# Altium project BV100011_UniversalSlave.PrjPCB (part 1 of 2)
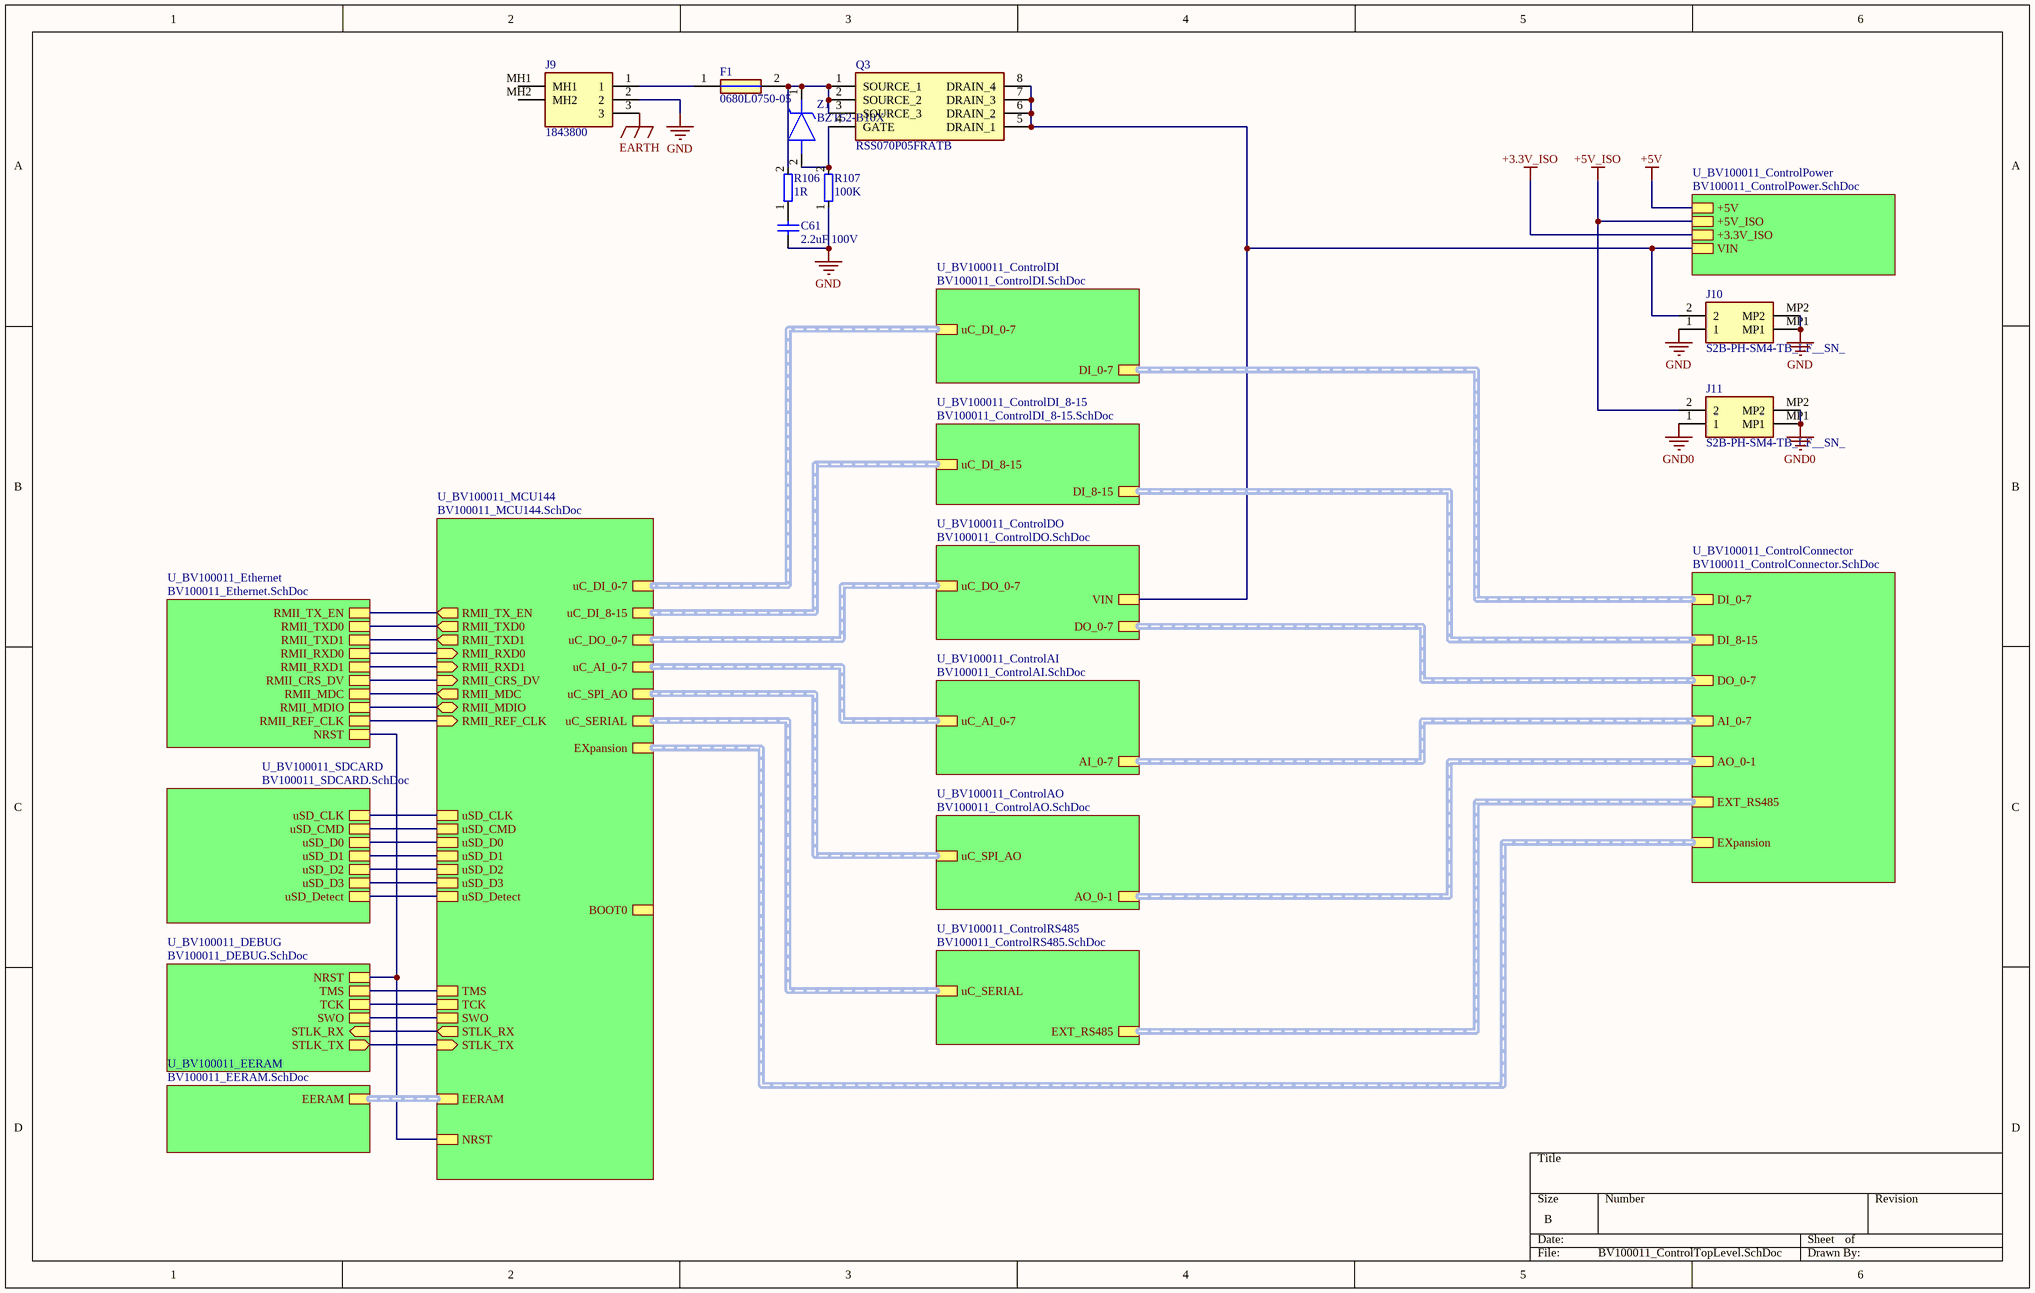
[diagram p0: BV100011_ControlTopLevel.SchDoc]
14 sheets, 453 parts. Net scope: hierarchical (ports join the sheet entries above them; power ports are global).
Board file: BV100011_UniversalSlave.PcbDoc
Sheets:
  BV100011_ControlTopLevel.SchDoc
    U_BV100011_ControlAI = BV100011_ControlAI.SchDoc
    U_BV100011_ControlAO = BV100011_ControlAO.SchDoc
    U_BV100011_ControlDI = BV100011_ControlDI.SchDoc
    U_BV100011_ControlDO = BV100011_ControlDO.SchDoc
    U_BV100011_ControlRS485 = BV100011_ControlRS485.SchDoc
    U_BV100011_ControlPower = BV100011_ControlPower.SchDoc
    U_BV100011_ControlDI_8-15 = BV100011_ControlDI_8-15.SchDoc
    U_BV100011_SDCARD = BV100011_SDCARD.SchDoc
    U_BV100011_Ethernet = BV100011_Ethernet.SchDoc
    U_BV100011_DEBUG = BV100011_DEBUG.SchDoc
    U_BV100011_EERAM = BV100011_EERAM.SchDoc
    U_BV100011_MCU144 = BV100011_MCU144.SchDoc
    U_BV100011_ControlConnector = BV100011_ControlConnector.SchDoc

## Sheet BV100011_ControlTopLevel.SchDoc
size B

### Parts
C61  2.2uF 100V  [C1210]
F1  0680L0750-05  [FUSC6125X279N]
J9  1843800  [1843800]
J10  S2B-PH-SM4-TB_LF__SN_  [S2BPHSM4TBLFSN]
J11  S2B-PH-SM4-TB_LF__SN_  [S2BPHSM4TBLFSN]
Q3  RSS070P05FRATB  [SOIC127P600X175-8N]
R106  1R  [R0805]
R107  100K  [R0603]
Z1  BZT52-B10X  [SODFL3616X130N]

### Sub-sheets
U_BV100011_ControlAI = BV100011_ControlAI.SchDoc: uC_AI_0-7 (harness uC_AI_0-7), AI_0-7 (harness AI_0-7)
U_BV100011_ControlAO = BV100011_ControlAO.SchDoc: AO_0-1 (harness AO_0-1), uC_SPI_AO (harness uC_SPI_AO)
U_BV100011_ControlConnector = BV100011_ControlConnector.SchDoc: DI_0-7 (harness DI_0-7), AI_0-7 (harness AI_0-7), DO_0-7 (harness DO_0-7), AO_0-1 (harness AO_0-1), EXT_RS485 (harness EXT_RS485), DI_8-15 (harness DI_8-15), EXpansion (harness Expansion)
U_BV100011_ControlDI = BV100011_ControlDI.SchDoc: DI_0-7 (harness DI_0-7), uC_DI_0-7 (harness uC_DI_0-7)
U_BV100011_ControlDI_8-15 = BV100011_ControlDI_8-15.SchDoc: DI_8-15 (harness DI_8-15), uC_DI_8-15 (harness uC_DI_8-15)
U_BV100011_ControlDO = BV100011_ControlDO.SchDoc: DO_0-7 (harness DO_0-7), uC_DO_0-7 (harness uC_DO_0-7), VIN
U_BV100011_ControlPower = BV100011_ControlPower.SchDoc: VIN, +5V, +5V_ISO, +3.3V_ISO
U_BV100011_ControlRS485 = BV100011_ControlRS485.SchDoc: uC_SERIAL (harness uC_SERIAL), EXT_RS485 (harness EXT_RS485)
U_BV100011_DEBUG = BV100011_DEBUG.SchDoc: TMS, TCK, SWO, NRST, STLK_RX (in), STLK_TX (out)
U_BV100011_EERAM = BV100011_EERAM.SchDoc: EERAM (harness EERAM)
U_BV100011_Ethernet = BV100011_Ethernet.SchDoc: RMII_TXD0, RMII_TX_EN, RMII_RXD0, RMII_REF_CLK, RMII_CRS_DV, RMII_MDC, RMII_MDIO, NRST, RMII_TXD1, RMII_RXD1
U_BV100011_MCU144 = BV100011_MCU144.SchDoc: NRST, TCK, TMS, SWO, BOOT0, uC_DI_0-7 (harness uC_DI_0-7), uC_DI_8-15 (harness uC_DI_8-15), uC_DO_0-7 (harness uC_DO_0-7), uC_SPI_AO (harness uC_SPI_AO), uC_SERIAL (harness uC_SERIAL), uSD_CLK, uSD_CMD, uSD_D0, uSD_D1, uSD_D2, uSD_D3, uSD_Detect, RMII_REF_CLK (in), RMII_MDIO (bidir), RMII_CRS_DV (in), RMII_RXD0 (in), RMII_MDC (out), RMII_RXD1 (in), RMII_TXD1 (out), RMII_TXD0 (out), RMII_TX_EN (out), STLK_RX (out), STLK_TX (in), uC_AI_0-7 (harness uC_AI_0-7), EERAM (harness EERAM), EXpansion (harness Expansion)
U_BV100011_SDCARD = BV100011_SDCARD.SchDoc: uSD_CLK, uSD_CMD, uSD_D0, uSD_D1, uSD_D2, uSD_D3, uSD_Detect

### Nets
+5V_ISO: J11.2 ; sheet U_BV100011_ControlPower/+5V_ISO
EARTH: J9.3
GND: C61.1 J9.2 J10.1 J10.MP1 J10.MP2 R107.1
GND0: J11.1 J11.MP1 J11.MP2
NRST: sheet U_BV100011_Ethernet/NRST, sheet U_BV100011_DEBUG/NRST, sheet U_BV100011_MCU144/NRST
PA1: sheet U_BV100011_Ethernet/RMII_REF_CLK, sheet U_BV100011_MCU144/RMII_REF_CLK
PA2: sheet U_BV100011_Ethernet/RMII_MDIO, sheet U_BV100011_MCU144/RMII_MDIO
PA7: sheet U_BV100011_Ethernet/RMII_CRS_DV, sheet U_BV100011_MCU144/RMII_CRS_DV
PA13: sheet U_BV100011_DEBUG/TMS, sheet U_BV100011_MCU144/TMS
PA14: sheet U_BV100011_DEBUG/TCK, sheet U_BV100011_MCU144/TCK
PB3: sheet U_BV100011_DEBUG/SWO, sheet U_BV100011_MCU144/SWO
PB13: sheet U_BV100011_Ethernet/RMII_TXD1, sheet U_BV100011_MCU144/RMII_TXD1
PC1: sheet U_BV100011_Ethernet/RMII_MDC, sheet U_BV100011_MCU144/RMII_MDC
PC4: sheet U_BV100011_Ethernet/RMII_RXD0, sheet U_BV100011_MCU144/RMII_RXD0
PC5: sheet U_BV100011_Ethernet/RMII_RXD1, sheet U_BV100011_MCU144/RMII_RXD1
PC8: sheet U_BV100011_SDCARD/uSD_D0, sheet U_BV100011_MCU144/uSD_D0
PC9: sheet U_BV100011_SDCARD/uSD_D1, sheet U_BV100011_MCU144/uSD_D1
PC10: sheet U_BV100011_SDCARD/uSD_D2, sheet U_BV100011_MCU144/uSD_D2
PC11: sheet U_BV100011_SDCARD/uSD_D3, sheet U_BV100011_MCU144/uSD_D3
PC12: sheet U_BV100011_SDCARD/uSD_CLK, sheet U_BV100011_MCU144/uSD_CLK
PD2: sheet U_BV100011_SDCARD/uSD_CMD, sheet U_BV100011_MCU144/uSD_CMD
PD3: sheet U_BV100011_SDCARD/uSD_Detect, sheet U_BV100011_MCU144/uSD_Detect
PD8: sheet U_BV100011_DEBUG/STLK_RX, sheet U_BV100011_MCU144/STLK_RX
PD9: sheet U_BV100011_DEBUG/STLK_TX, sheet U_BV100011_MCU144/STLK_TX
PG11: sheet U_BV100011_Ethernet/RMII_TX_EN, sheet U_BV100011_MCU144/RMII_TX_EN
PG13: sheet U_BV100011_Ethernet/RMII_TXD0, sheet U_BV100011_MCU144/RMII_TXD0
VIN: J10.2 Q3.5(DRAIN_1) Q3.6(DRAIN_2) Q3.7(DRAIN_3) Q3.8(DRAIN_4) ; sheet U_BV100011_ControlDO/VIN, sheet U_BV100011_ControlPower/VIN
NetC61_2: C61.2 R106.1
NetF1_1: F1.1 J9.1
NetF1_2: F1.2 Q3.1(SOURCE_1) Q3.2(SOURCE_2) Q3.3(SOURCE_3) R106.2 Z1.1(K)
NetQ3_4: Q3.4(GATE) R107.2 Z1.2(A)

Not connected (* = marked no-connect by the designer): J9 MH1 MH2

### Buses and harness runs
harness sheet U_BV100011_ControlAI/AI_0-7 = sheet U_BV100011_ControlConnector/AI_0-7
harness sheet U_BV100011_ControlAI/uC_AI_0-7 = sheet U_BV100011_MCU144/uC_AI_0-7
harness sheet U_BV100011_ControlAO/AO_0-1 = sheet U_BV100011_ControlConnector/AO_0-1
harness sheet U_BV100011_ControlAO/uC_SPI_AO = sheet U_BV100011_MCU144/uC_SPI_AO
harness sheet U_BV100011_ControlConnector/DI_0-7 = sheet U_BV100011_ControlDI/DI_0-7
harness sheet U_BV100011_ControlConnector/DI_8-15 = sheet U_BV100011_ControlDI_8-15/DI_8-15
harness sheet U_BV100011_ControlConnector/DO_0-7 = sheet U_BV100011_ControlDO/DO_0-7
harness sheet U_BV100011_ControlConnector/EXpansion = sheet U_BV100011_MCU144/EXpansion
harness sheet U_BV100011_ControlConnector/EXT_RS485 = sheet U_BV100011_ControlRS485/EXT_RS485
harness sheet U_BV100011_ControlDI/uC_DI_0-7 = sheet U_BV100011_MCU144/uC_DI_0-7
harness sheet U_BV100011_ControlDI_8-15/uC_DI_8-15 = sheet U_BV100011_MCU144/uC_DI_8-15
harness sheet U_BV100011_ControlDO/uC_DO_0-7 = sheet U_BV100011_MCU144/uC_DO_0-7
harness sheet U_BV100011_ControlRS485/uC_SERIAL = sheet U_BV100011_MCU144/uC_SERIAL
harness sheet U_BV100011_EERAM/EERAM = sheet U_BV100011_MCU144/EERAM

### Library data of the parts
C61 = Cap: Capacitor; Value: 0.01uF; Published: 8-Jun-2000; LatestRevisionDate: 17-Jul-2002; LatestRevisionNote: Re-released for DXP Platform.; PackageReference: RAD-0.3; Publisher: Altium Limited
F1 = 0680L0750-05: Fuse; Manufacturer_Name: Stewart Connector; Datasheet Link: https://belfuse.com/resources/datasheets/circuitprotection/ds-cp-0680l-series.pdf; Height: 2.79mm; Manufacturer_Part_Number: 0680L0750-05; Mouser Part Number: 530-0680L0750-05; Mouser Price/Stock: https://www.mouser.co.uk/ProductDetail/Bel-Fuse/0680L0750-05?qs=XeJtXLiO41Q8xKKngRilvg%3D%3D
J9 = 1843800: Connector; Manufacturer_Name: Phoenix Contact; Datasheet Link: https://www.phoenixcontact.com/online/portal/gb?uri=pxc-oc-itemdetail:pid=1843800&library=gben&tab=1; Height: 7.4mm; Manufacturer_Part_Number: 1843800; Arrow Part Number: 1843800; Arrow Price/Stock: https://www.arrow.com/en/products/1843800/phoenix-contact; Mouser Part Number: 651-1843800; Mouser Price/Stock: https://www.mouser.co.uk/ProductDetail/Phoenix-Contact/1843800?qs=uJX40y%252BSWqgV2WPXXVa%2FDw%3D%3D
J10 J11 = S2B-PH-SM4-TB_LF__SN_: Connector; Manufacturer_Name: JST Sales America; Manufacturer_Part_Number: S2B-PH-SM4-TB(LF)(SN); Datasheet Link: https://www.jst-mfg.com/product/pdf/eng/ePH.pdf; Height: 6.6mm
Q3 = RSS070P05FRATB: MOSFET (P-Channel); Manufacturer_Name: ROHM Semiconductor; Datasheet Link: https://d1d2qsbl8m0m72.cloudfront.net/en/products/databook/datasheet/discrete/transistor/mosfet/rss070p05fra-e.pdf; Height: 1.75mm; Manufacturer_Part_Number: RSS070P05FRATB; Mouser Part Number: 755-RSS070P05FRATB; Mouser Price/Stock: https://www.mouser.com/Search/Refine.aspx?Keyword=755-RSS070P05FRATB
R106 R107 = µç×è£¨1£©: Resistor
Z1 = BZT52-B10X: Zener Diode; Manufacturer_Name: Nexperia; Datasheet Link: https://componentsearchengine.com/Datasheets/2/BZT52-B10X.pdf; Height: 1.3mm; Manufacturer_Part_Number: BZT52-B10X; Arrow Part Number: BZT52-B10X; Arrow Price/Stock: https://www.arrow.com/en/products/bzt52-b10x/nexperia; Mouser Part Number: 771-BZT52-B10X; Mouser Price/Stock: https://www.mouser.co.uk/ProductDetail/Nexperia/BZT52-B10X?qs=W0yvOO0ixfEZrHW2hWNc1Q%3D%3D

## Sheet BV100011_ControlAI.SchDoc
size C
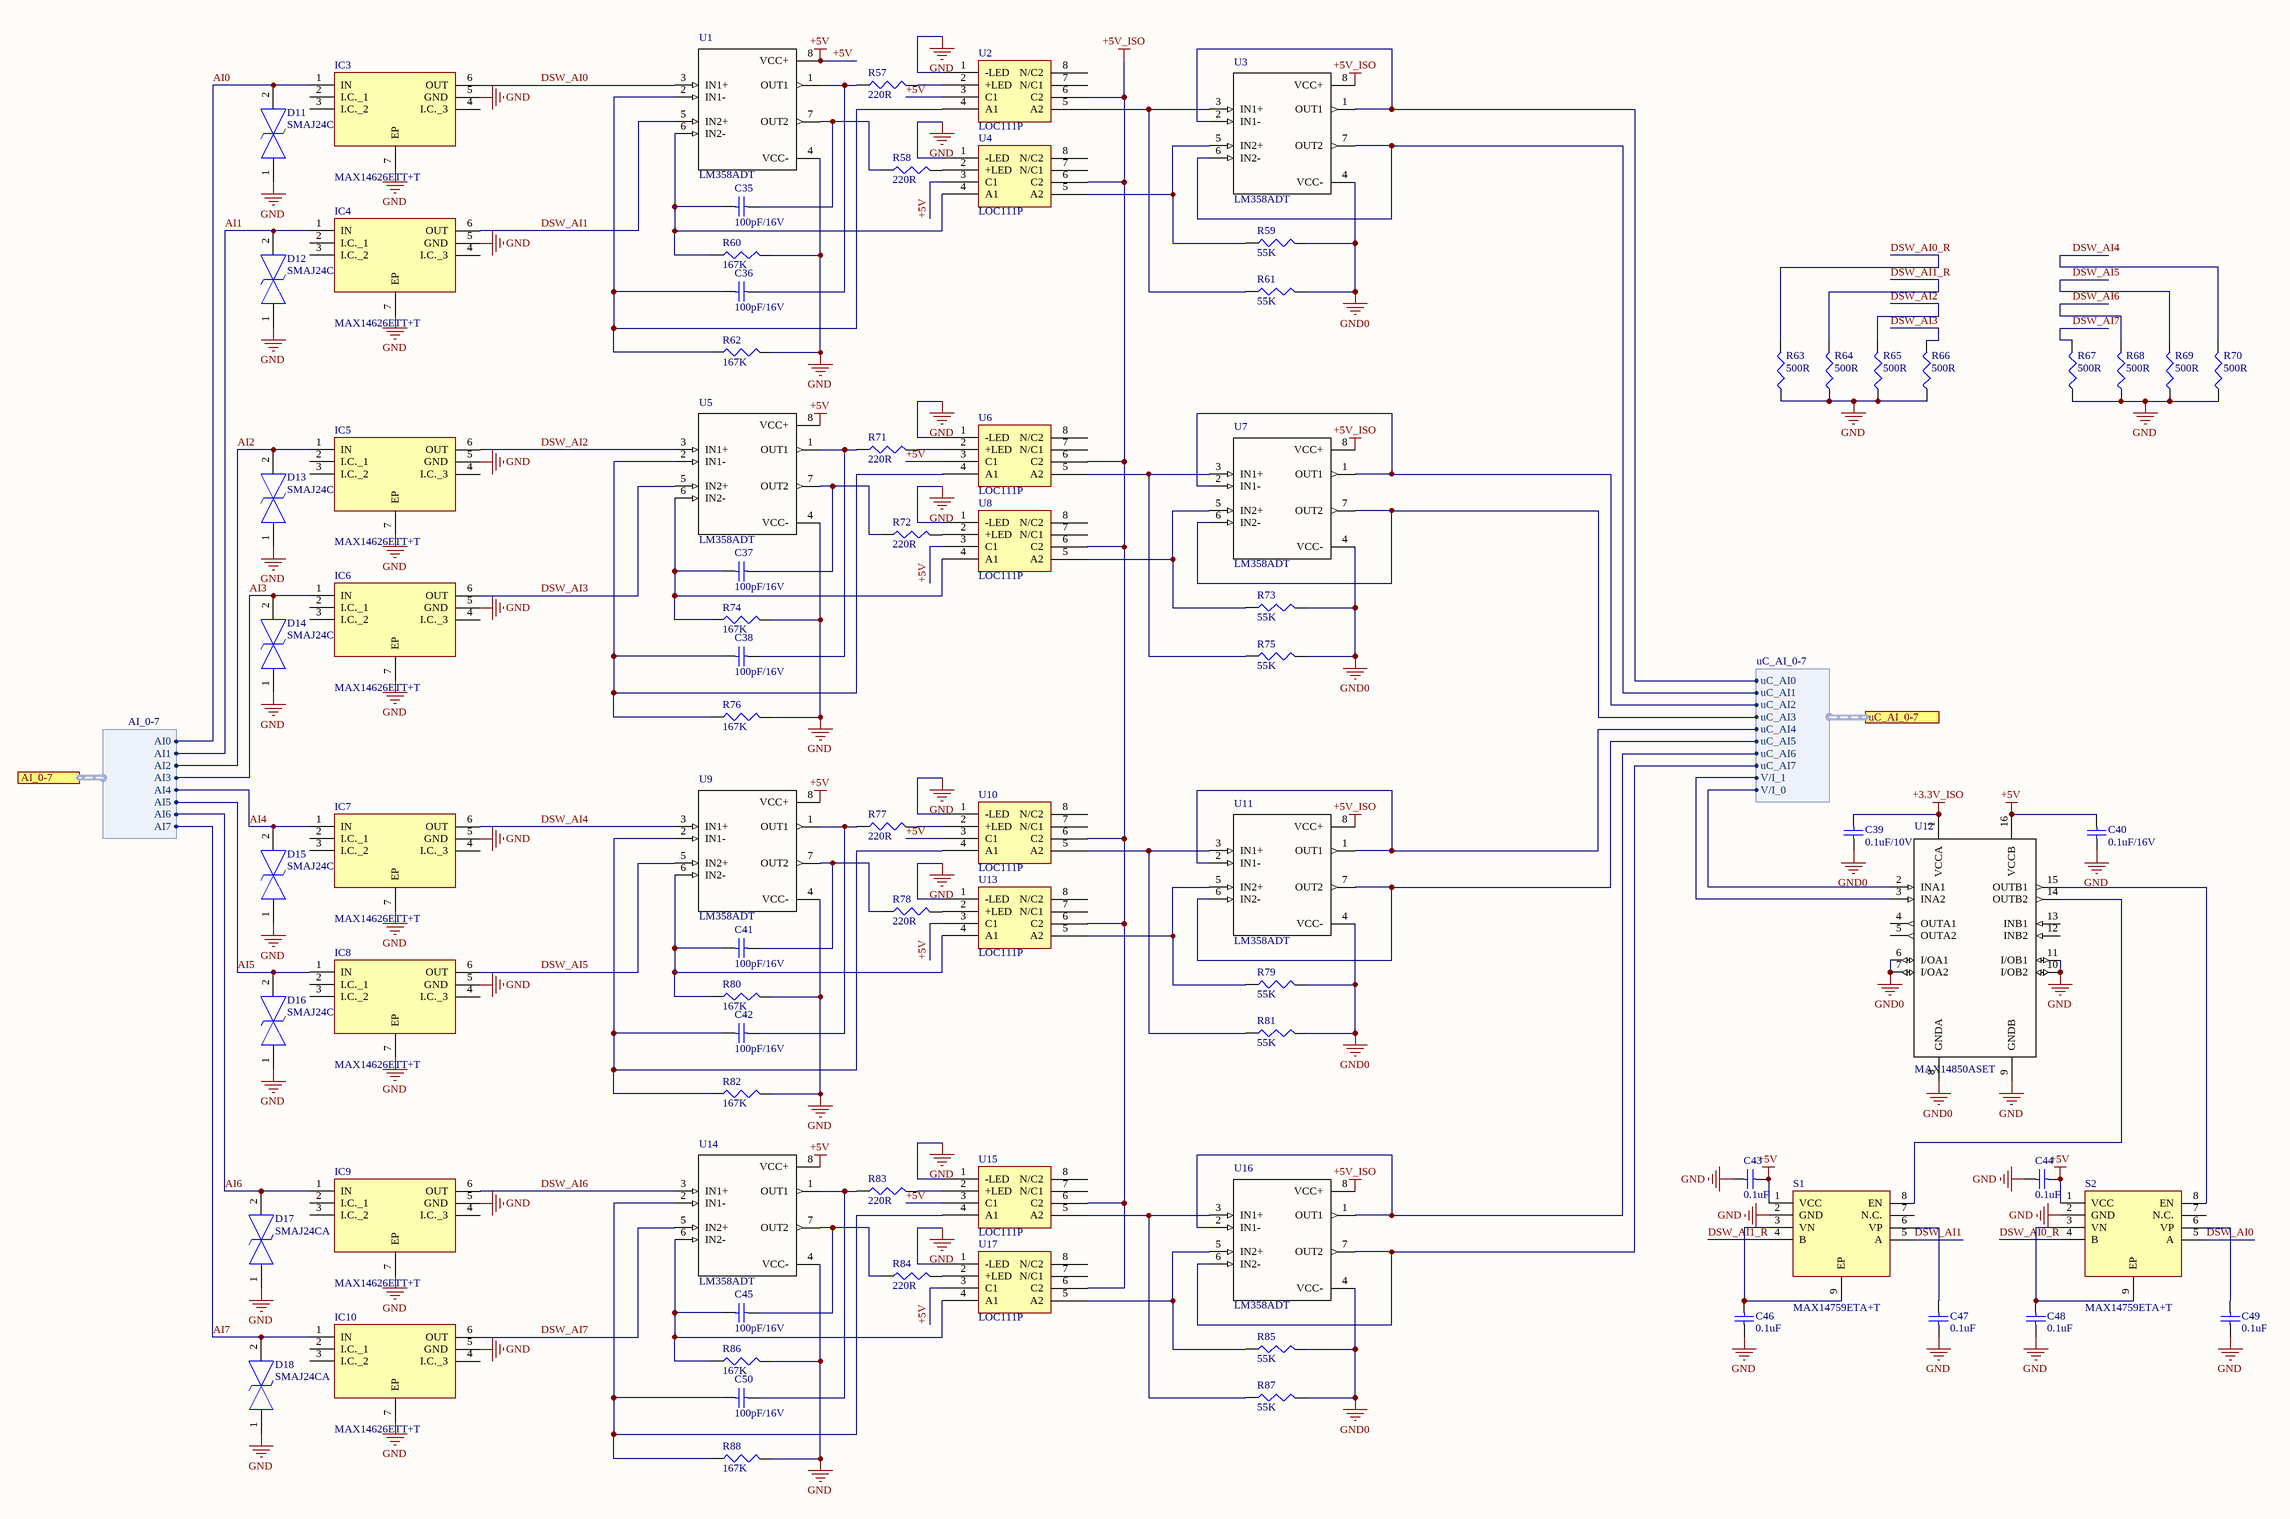
[diagram p1: BV100011_ControlAI.SchDoc]

### Parts
C35  100pF/16V  [C1206]
C36  100pF/16V  [C1206]
C37  100pF/16V  [C1206]
C38  100pF/16V  [C1206]
C39  0.1uF/10V  [C1206]
C40  0.1uF/16V  [C1206]
C41  100pF/16V  [C1206]
C42  100pF/16V  [C1206]
C43  0.1uF  [C1206]
C44  0.1uF  [C1206]
C45  100pF/16V  [C1206]
C46  0.1uF  [C1206]
C47  0.1uF  [C1206]
C48  0.1uF  [C1206]
C49  0.1uF  [C1206]
C50  100pF/16V  [C1206]
D11  SMAJ24CA  [DIONM5026X229N]
D12  SMAJ24CA  [DIONM5026X229N]
D13  SMAJ24CA  [DIONM5026X229N]
D14  SMAJ24CA  [DIONM5026X229N]
D15  SMAJ24CA  [DIONM5026X229N]
D16  SMAJ24CA  [DIONM5026X229N]
D17  SMAJ24CA  [DIONM5026X229N]
D18  SMAJ24CA  [DIONM5026X229N]
IC3  MAX14626ETT+T  [SON95P300X300X80-7N]
IC4  MAX14626ETT+T  [SON95P300X300X80-7N]
IC5  MAX14626ETT+T  [SON95P300X300X80-7N]
IC6  MAX14626ETT+T  [SON95P300X300X80-7N]
IC7  MAX14626ETT+T  [SON95P300X300X80-7N]
IC8  MAX14626ETT+T  [SON95P300X300X80-7N]
IC9  MAX14626ETT+T  [SON95P300X300X80-7N]
IC10  MAX14626ETT+T  [SON95P300X300X80-7N]
R57  220R  [J1-0603]
R58  220R  [J1-0603]
R59  55K  [J1-0603]
R60  167K  [J1-0603]
R61  55K  [J1-0603]
R62  167K  [J1-0603]
R63  500R  [14-1210]
R64  500R  [14-1210]
R65  500R  [14-1210]
R66  500R  [14-1210]
R67  500R  [14-1210]
R68  500R  [14-1210]
R69  500R  [14-1210]
R70  500R  [14-1210]
R71  220R  [J1-0603]
R72  220R  [J1-0603]
R73  55K  [J1-0603]
R74  167K  [J1-0603]
R75  55K  [J1-0603]
R76  167K  [J1-0603]
R77  220R  [J1-0603]
R78  220R  [J1-0603]
R79  55K  [J1-0603]
R80  167K  [J1-0603]
R81  55K  [J1-0603]
R82  167K  [J1-0603]
R83  220R  [J1-0603]
R84  220R  [J1-0603]
R85  55K  [J1-0603]
R86  167K  [J1-0603]
R87  55K  [J1-0603]
R88  167K  [J1-0603]
S1  MAX14759ETA+T  [SON65P300X300X80-9N]
S2  MAX14759ETA+T  [SON65P300X300X80-9N]
U1  LM358ADT  [*SOIC127P600X175-8N]
U2  LOC111P  [SOP254P940X265-8N]
U3  LM358ADT  [*SOIC127P600X175-8N]
U4  LOC111P  [SOP254P940X265-8N]
U5  LM358ADT  [*SOIC127P600X175-8N]
U6  LOC111P  [SOP254P940X265-8N]
U7  LM358ADT  [*SOIC127P600X175-8N]
U8  LOC111P  [SOP254P940X265-8N]
U9  LM358ADT  [*SOIC127P600X175-8N]
U10  LOC111P  [SOP254P940X265-8N]
U11  LM358ADT  [*SOIC127P600X175-8N]
U12  MAX14850ASET  [*SOIC127P600X175-16N]
U13  LOC111P  [SOP254P940X265-8N]
U14  LM358ADT  [*SOIC127P600X175-8N]
U15  LOC111P  [SOP254P940X265-8N]
U16  LM358ADT  [*SOIC127P600X175-8N]
U17  LOC111P  [SOP254P940X265-8N]

### Ports
AI_0-7 (harness AI_0-7), uC_AI_0-7 (harness uC_AI_0-7)

### Harnesses
uC_AI_0-7: uC_AI0, uC_AI1, uC_AI2, uC_AI3, uC_AI4, uC_AI5, uC_AI6, uC_AI7, V/I_0, V/I_1
AI_0-7: AI0, AI1, AI2, AI3, AI4, AI5, AI6, AI7

### Nets
+3.3V_ISO: C39.1 U12.1(VCCA)
+5V: C40.1 C43.2 C44.2 S1.1(VCC) S2.1(VCC) U1.8(VCC+) U2.3(C1) U4.3(C1) U5.8(VCC+) U6.3(C1) U8.3(C1) U9.8(VCC+) U10.3(C1) U12.16(VCCB) U13.3(C1) U14.8(VCC+) U15.3(C1) U17.3(C1)
+5V_ISO: U2.6(C2) U3.8(VCC+) U4.6(C2) U6.6(C2) U7.8(VCC+) U8.6(C2) U10.6(C2) U11.8(VCC+) U13.6(C2) U15.6(C2) U16.8(VCC+) U17.6(C2)
GND: C40.2 C43.1 C44.1 C46.2 C47.2 C48.2 C49.2 D11.1(K) D12.1(K) D13.1(K) D14.1(K) D15.1(K) D16.1(K) D17.1(K) D18.1(K) IC3.5(GND) IC3.7(EP) IC4.5(GND) IC4.7(EP) IC5.5(GND) IC5.7(EP) IC6.5(GND) IC6.7(EP) IC7.5(GND) IC7.7(EP) IC8.5(GND) IC8.7(EP) IC9.5(GND) IC9.7(EP) IC10.5(GND) IC10.7(EP) R60.2 R62.2 R63.1 R64.1 R65.1 R66.1 R67.1 R68.1 R69.1 R70.1 R74.2 R76.2 R80.2 R82.2 R86.2 R88.2 S1.2(GND) S2.2(GND) U1.4(VCC-) U2.1(-LED) U4.1(-LED) U5.4(VCC-) U6.1(-LED) U8.1(-LED) U9.4(VCC-) U10.1(-LED) U12.9(GNDB) U12.10(I/OB2) U12.11(I/OB1) U13.1(-LED) U14.4(VCC-) U15.1(-LED) U17.1(-LED)
GND0: C39.2 R59.2 R61.2 R73.2 R75.2 R79.2 R81.2 R85.2 R87.2 U3.4(VCC-) U7.4(VCC-) U11.4(VCC-) U12.6(I/OA1) U12.7(I/OA2) U12.8(GNDA) U16.4(VCC-)
AI0: D11.2(A) IC3.1(IN) ; port AI_0-7.AI0
AI1: D12.2(A) IC4.1(IN) ; port AI_0-7.AI1
AI2: D13.2(A) IC5.1(IN) ; port AI_0-7.AI2
AI3: D14.2(A) IC6.1(IN) ; port AI_0-7.AI3
AI4: D15.2(A) IC7.1(IN) ; port AI_0-7.AI4
AI5: D16.2(A) IC8.1(IN) ; port AI_0-7.AI5
AI6: D17.2(A) IC9.1(IN) ; port AI_0-7.AI6
AI7: D18.2(A) IC10.1(IN) ; port AI_0-7.AI7
DSW_AI0: IC3.6(OUT) S2.5(A) U1.3(IN1+)
DSW_AI0_R: R63.2 S2.4(B)
DSW_AI1: IC4.6(OUT) S1.5(A) U1.5(IN2+)
DSW_AI1_R: R64.2 S1.4(B)
DSW_AI2: IC5.6(OUT) R65.2 U5.3(IN1+)
DSW_AI3: IC6.6(OUT) R66.2 U5.5(IN2+)
DSW_AI4: IC7.6(OUT) R70.2 U9.3(IN1+)
DSW_AI5: IC8.6(OUT) R69.2 U9.5(IN2+)
DSW_AI6: IC9.6(OUT) R68.2 U14.3(IN1+)
DSW_AI7: IC10.6(OUT) R67.2 U14.5(IN2+)
PA0: U3.1(OUT1) U3.2(IN1-) ; port uC_AI_0-7.uC_AI0
PA3: U3.6(IN2-) U3.7(OUT2) ; port uC_AI_0-7.uC_AI1
PA4: U7.1(OUT1) U7.2(IN1-) ; port uC_AI_0-7.uC_AI2
PA5: U7.6(IN2-) U7.7(OUT2) ; port uC_AI_0-7.uC_AI3
PA6: U11.1(OUT1) U11.2(IN1-) ; port uC_AI_0-7.uC_AI4
PB1: U11.6(IN2-) U11.7(OUT2) ; port uC_AI_0-7.uC_AI5
PC0: U16.1(OUT1) U16.2(IN1-) ; port uC_AI_0-7.uC_AI6
PC3: U16.6(IN2-) U16.7(OUT2) ; port uC_AI_0-7.uC_AI7
PG0: U12.2(INA1) ; port uC_AI_0-7.V/I_0
PG1: U12.3(INA2) ; port uC_AI_0-7.V/I_1
NetC35_1: C35.1 R60.1 U1.6(IN2-) U4.4(A1)
NetC35_2: C35.2 R58.1 U1.7(OUT2)
NetC36_1: C36.1 R62.1 U1.2(IN1-) U2.4(A1)
NetC36_2: C36.2 R57.1 U1.1(OUT1)
NetC37_1: C37.1 R74.1 U5.6(IN2-) U8.4(A1)
NetC37_2: C37.2 R72.1 U5.7(OUT2)
NetC38_1: C38.1 R76.1 U5.2(IN1-) U6.4(A1)
NetC38_2: C38.2 R71.1 U5.1(OUT1)
NetC41_1: C41.1 R80.1 U9.6(IN2-) U13.4(A1)
NetC41_2: C41.2 R78.1 U9.7(OUT2)
NetC42_1: C42.1 R82.1 U9.2(IN1-) U10.4(A1)
NetC42_2: C42.2 R77.1 U9.1(OUT1)
NetC45_1: C45.1 R86.1 U14.6(IN2-) U17.4(A1)
NetC45_2: C45.2 R84.1 U14.7(OUT2)
NetC46_1: C46.1 S1.3(VN) S1.9(EP)
NetC47_1: C47.1 S1.6(VP)
NetC48_1: C48.1 S2.3(VN) S2.9(EP)
NetC49_1: C49.1 S2.6(VP)
NetC50_1: C50.1 R88.1 U14.2(IN1-) U15.4(A1)
NetC50_2: C50.2 R83.1 U14.1(OUT1)
NetR57_2: R57.2 U2.2(+LED)
NetR58_2: R58.2 U4.2(+LED)
NetR59_1: R59.1 U3.5(IN2+) U4.5(A2)
NetR61_1: R61.1 U2.5(A2) U3.3(IN1+)
NetR71_2: R71.2 U6.2(+LED)
NetR72_2: R72.2 U8.2(+LED)
NetR73_1: R73.1 U7.5(IN2+) U8.5(A2)
NetR75_1: R75.1 U6.5(A2) U7.3(IN1+)
NetR77_2: R77.2 U10.2(+LED)
NetR78_2: R78.2 U13.2(+LED)
NetR79_1: R79.1 U11.5(IN2+) U13.5(A2)
NetR81_1: R81.1 U10.5(A2) U11.3(IN1+)
NetR83_2: R83.2 U15.2(+LED)
NetR84_2: R84.2 U17.2(+LED)
NetR85_1: R85.1 U16.5(IN2+) U17.5(A2)
NetR87_1: R87.1 U15.5(A2) U16.3(IN1+)
NetS1_8: S1.8(EN) U12.14(OUTB2)
NetS2_8: S2.8(EN) U12.15(OUTB1)

Not connected (* = marked no-connect by the designer): IC3 2(I.C._1) 3(I.C._2) 4(I.C._3); IC4 2(I.C._1) 3(I.C._2) 4(I.C._3); IC5 2(I.C._1) 3(I.C._2) 4(I.C._3); IC6 2(I.C._1) 3(I.C._2) 4(I.C._3); IC7 2(I.C._1) 3(I.C._2) 4(I.C._3); IC8 2(I.C._1) 3(I.C._2) 4(I.C._3); IC9 2(I.C._1) 3(I.C._2) 4(I.C._3); IC10 2(I.C._1) 3(I.C._2) 4(I.C._3); S1 7(N.C.); S2 7(N.C.); U2 7(N/C1) 8(N/C2); U4 7(N/C1) 8(N/C2); U6 7(N/C1) 8(N/C2); U8 7(N/C1) 8(N/C2); U10 7(N/C1) 8(N/C2); U12 4(OUTA1) 5(OUTA2) 12(INB2) 13(INB1); U13 7(N/C1) 8(N/C2); U15 7(N/C1) 8(N/C2); U17 7(N/C1) 8(N/C2)

### Library data of the parts
C35-C42 C45 C50 = Cap Semi: Capacitor (Semiconductor SIM Model); Published: 8-Jun-2000; LatestRevisionDate: 29-May-2009; LatestRevisionNote: IPC-7351 Footprint Added.; PackageReference: C1206; Publisher: Altium Limited; PackageDescription: Chip Capacitor
  C35-C38 C41 C42 C45 C50: Value: 100pF/16V
  C39: Value: 0.1uF/10V
  C40: Value: 0.1uF/16V
C43 C44 C46-C49 = Cap Semi: Capacitor (Semiconductor SIM Model); Value: 100pF/16V; Published: 8-Jun-2000; LatestRevisionDate: 29-May-2009; LatestRevisionNote: IPC-7351 Footprint Added.; PackageReference: C1206; Publisher: Altium Limited; PackageDescription: Chip Capacitor
D11-D18 = SMAJ24CA: TVS Diode (Bi-directional); Manufacturer_Name: LITTELFUSE; Datasheet Link: http://www.littelfuse.com/~/media/electronics/datasheets/tvs_diodes/littelfuse_tvs_diode_smaj_datasheet.pdf.pdf; Height: 2.29mm; Manufacturer_Part_Number: SMAJ24CA; Mouser Part Number: 576-SMAJ24CA; Mouser Price/Stock: https://www.mouser.com/Search/Refine.aspx?Keyword=576-SMAJ24CA; RS Part Number: 1719613P; RS Price/Stock: http://uk.rs-online.com/web/p/products/1719613P
IC3-IC10 = MAX14626ETT+T: Integrated Circuit; Manufacturer_Name: Maxim Integrated; Datasheet Link: http://datasheets.maximintegrated.com/en/ds/MAX14626.pdf; Height: 0.8mm; Manufacturer_Part_Number: MAX14626ETT+T; Mouser Part Number: 700-MAX14626ETT+T; Mouser Price/Stock: https://www.mouser.co.uk/ProductDetail/Maxim-Integrated/MAX14626ETT%2bT?qs=Vwh6e7toGLjhMUByPdHdJg%3D%3D
R57-R88 = Res3: Resistor; Published: 8-Jun-2000; LatestRevisionDate: 29-May-2009; LatestRevisionNote: IPC-7351 Footprint Added.; PackageReference: J1-0603; Publisher: Altium Limited; PackageDescription: Chip Resistor
  R57 R58 R71 R72 R77 R78 R83 R84: Value: 220R
  R59 R61 R73 R75 R79 R81 R85 R87: Value: 55K
  R60 R62 R74 R76 R80 R82 R86 R88: Value: 167K
  R63-R70: Value: 500R
S1 S2 = MAX14759ETA+T: Switch; Manufacturer_Name: Maxim Integrated; Datasheet Link: https://datasheets.maximintegrated.com/en/ds/MAX14759-MAX14763.pdf; Height: 0.8mm; Manufacturer_Part_Number: MAX14759ETA+T; Mouser Part Number: 700-MAX14759ETA+T; Mouser Price/Stock: https://www.mouser.co.uk/ProductDetail/Maxim-Integrated/MAX14759ETA%2bT?qs=2cAdsCoAWRFgTjPJwgxqqQ%3D%3D
U1 U3 U5 U7 U9 U11 U14 U16 = LM358ADT: LM358 Series 30 V 1.1 MHz Low Power Dual Operational Amplifier - SOIC-8; MF: STMicroelectronics; SnapEDA_Link: https://www.snapeda.com/parts/LM358ADT/STMicroelectronics/view-part/?ref=snap; MP: LM358ADT; Availability: Unavailable; Price: None; Package: SOIC-8 STMicroelectronics; Value: *
U2 U4 U6 U8 U10 U13 U15 U17 = LOC111P: Linear Optocoupler
U12 = MAX14850ASET: Digital Isolator, 6-Ch, 30ns, Nsoic-16; MF: Maxim Integrated; MP: MAX14850ASE+; SnapEDA_Link: https://www.snapeda.com/parts/MAX14850ASE%2B/Maxim%20Integrated/view-part/?ref=snap; Availability: Unavailable; Price: None; Package: SOIC-16 Maxim; Value: *

## Sheet BV100011_ControlAO.SchDoc
size A2
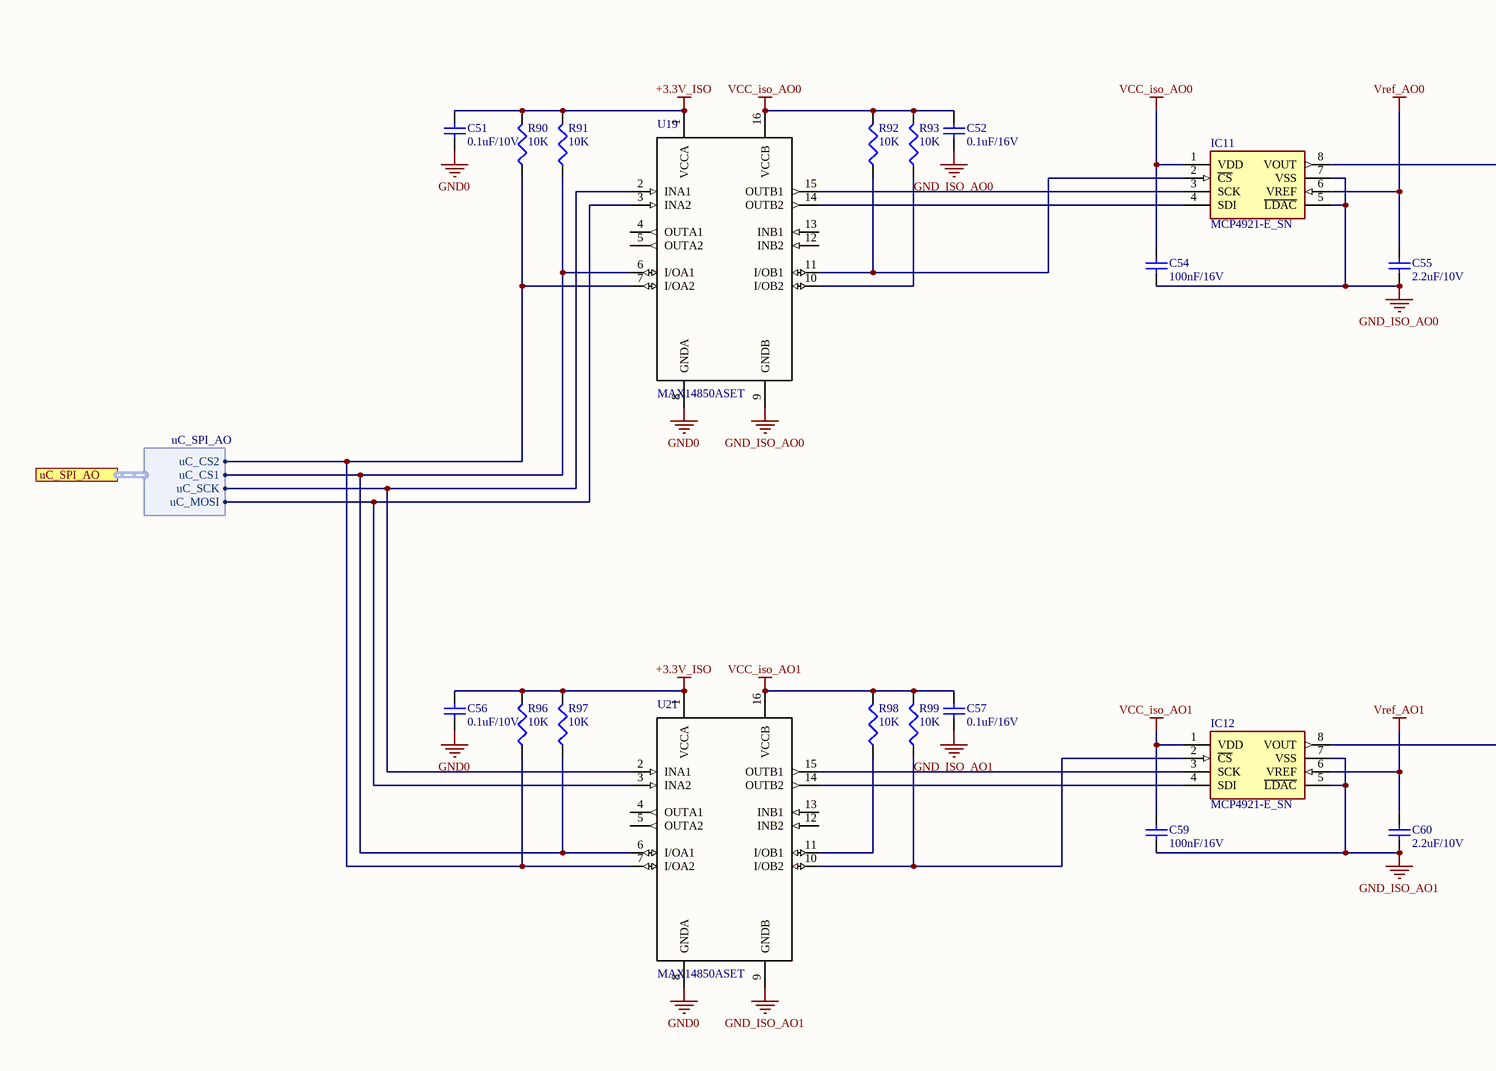
[diagram p2: BV100011_ControlAO.SchDoc, left]
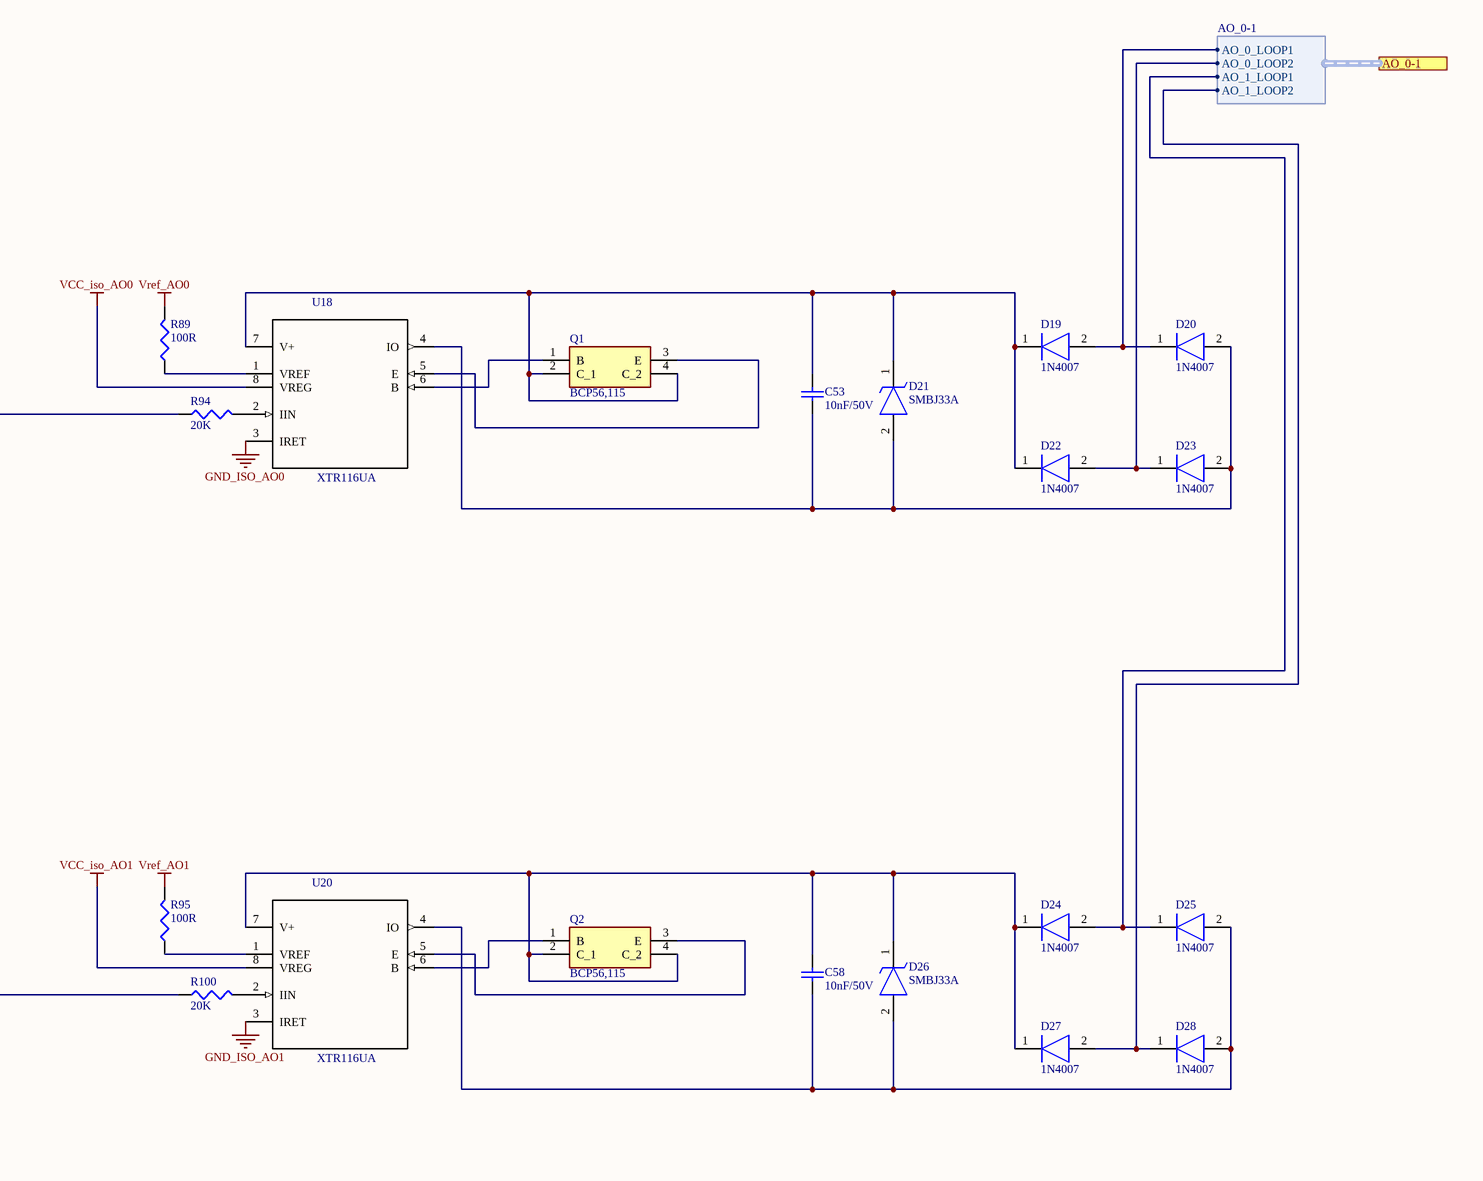
[diagram p3: BV100011_ControlAO.SchDoc, right]

### Parts
C51  0.1uF/10V  [C1206]
C52  0.1uF/16V  [C1206]
C53  10nF/50V  [C1210]
C54  100nF/16V  [C1206]
C55  2.2uF/10V  [C1206]
C56  0.1uF/10V  [C1206]
C57  0.1uF/16V  [C1206]
C58  10nF/50V  [C1210]
C59  100nF/16V  [C1206]
C60  2.2uF/10V  [C1206]
D19  1N4007  [DIOM5327X242N]
D20  1N4007  [DIOM5327X242N]
D21  SMBJ33A  [DIOM5336X265N]
D22  1N4007  [DIOM5327X242N]
D23  1N4007  [DIOM5327X242N]
D24  1N4007  [DIOM5327X242N]
D25  1N4007  [DIOM5327X242N]
D26  SMBJ33A  [DIOM5336X265N]
D27  1N4007  [DIOM5327X242N]
D28  1N4007  [DIOM5327X242N]
IC11  MCP4921-E_SN  [SOIC127P600X175-8N]
IC12  MCP4921-E_SN  [SOIC127P600X175-8N]
Q1  BCP56,115  [SOT230P700X180-4N]
Q2  BCP56,115  [SOT230P700X180-4N]
R89  100R  [J1-0603]
R90  10K  [J1-0603]
R91  10K  [J1-0603]
R92  10K  [J1-0603]
R93  10K  [J1-0603]
R94  20K  [J1-0603]
R95  100R  [J1-0603]
R96  10K  [J1-0603]
R97  10K  [J1-0603]
R98  10K  [J1-0603]
R99  10K  [J1-0603]
R100  20K  [J1-0603]
U18  XTR116UA  [*SOIC127P600X175-8N]
U19  MAX14850ASET  [*SOIC127P600X175-16N]
U20  XTR116UA  [*SOIC127P600X175-8N]
U21  MAX14850ASET  [*SOIC127P600X175-16N]

### Ports
AO_0-1 (harness AO_0-1), uC_SPI_AO (harness uC_SPI_AO)

### Harnesses
AO_0-1: AO_0_LOOP1, AO_0_LOOP2, AO_1_LOOP1, AO_1_LOOP2
uC_SPI_AO: uC_CS1, uC_CS2, uC_SCK, uC_MOSI

### Nets
+3.3V_ISO: C51.1 C56.1 R90.2 R91.2 R96.2 R97.2 U19.1(VCCA) U21.1(VCCA)
GND0: C51.2 C56.2 U19.8(GNDA) U21.8(GNDA)
GND_ISO_AO0: C52.2 C54.1 C55.1 IC11.5(~{LDAC}) IC11.7(VSS) U18.3(IRET) U19.9(GNDB)
GND_ISO_AO1: C57.2 C59.1 C60.1 IC12.5(~{LDAC}) IC12.7(VSS) U20.3(IRET) U21.9(GNDB)
VCC_iso_AO0: C52.1 C54.2 IC11.1(VDD) R92.2 R93.2 U18.8(VREG) U19.16(VCCB)
VCC_iso_AO1: C57.1 C59.2 IC12.1(VDD) R98.2 R99.2 U20.8(VREG) U21.16(VCCB)
Vref_AO0: C55.2 IC11.6(VREF) R89.2
Vref_AO1: C60.2 IC12.6(VREF) R95.2
PB10: U19.2(INA1) U21.2(INA1) ; port uC_SPI_AO.uC_SCK
PB11: R91.1 R97.1 U19.6(I/OA1) U21.6(I/OA1) ; port uC_SPI_AO.uC_CS1
PB12: R90.1 R96.1 U19.7(I/OA2) U21.7(I/OA2) ; port uC_SPI_AO.uC_CS2
PB15: U19.3(INA2) U21.3(INA2) ; port uC_SPI_AO.uC_MOSI
NetC53_1: C53.1 D20.2(A) D21.2(A) D23.2(A) U18.4(IO)
NetC53_2: C53.2 D19.1(K) D21.1(K) D22.1(K) Q1.2(C_1) Q1.4(C_2) U18.7(V+)
NetC58_1: C58.1 D25.2(A) D26.2(A) D28.2(A) U20.4(IO)
NetC58_2: C58.2 D24.1(K) D26.1(K) D27.1(K) Q2.2(C_1) Q2.4(C_2) U20.7(V+)
NetD19_2: D19.2(A) D20.1(K) ; port AO_0-1.AO_0_LOOP1
NetD22_2: D22.2(A) D23.1(K) ; port AO_0-1.AO_0_LOOP2
NetD24_2: D24.2(A) D25.1(K) ; port AO_0-1.AO_1_LOOP1
NetD27_2: D27.2(A) D28.1(K) ; port AO_0-1.AO_1_LOOP2
NetIC11_2: IC11.2(~{CS}) R92.1 U19.11(I/OB1)
NetIC11_3: IC11.3(SCK) U19.15(OUTB1)
NetIC11_4: IC11.4(SDI) U19.14(OUTB2)
NetIC11_8: IC11.8(VOUT) R94.1
NetIC12_2: IC12.2(~{CS}) R99.1 U21.10(I/OB2)
NetIC12_3: IC12.3(SCK) U21.15(OUTB1)
NetIC12_4: IC12.4(SDI) U21.14(OUTB2)
NetIC12_8: IC12.8(VOUT) R100.1
NetQ1_1: Q1.1(B) U18.6(B)
NetQ1_3: Q1.3(E) U18.5(E)
NetQ2_1: Q2.1(B) U20.6(B)
NetQ2_3: Q2.3(E) U20.5(E)
NetR89_1: R89.1 U18.1(VREF)
NetR93_1: R93.1 U19.10(I/OB2)
NetR94_2: R94.2 U18.2(IIN)
NetR95_1: R95.1 U20.1(VREF)
NetR98_1: R98.1 U21.11(I/OB1)
NetR100_2: R100.2 U20.2(IIN)

Not connected (* = marked no-connect by the designer): U19 4(OUTA1) 5(OUTA2) 12(INB2) 13(INB1); U21 4(OUTA1) 5(OUTA2) 12(INB2) 13(INB1)

### Library data of the parts
C51-C60 = Cap Semi: Capacitor (Semiconductor SIM Model); Published: 8-Jun-2000; LatestRevisionDate: 29-May-2009; LatestRevisionNote: IPC-7351 Footprint Added.; PackageReference: C1206; Publisher: Altium Limited; PackageDescription: Chip Capacitor
  C51 C56: Value: 0.1uF/10V
  C52 C57: Value: 0.1uF/16V
  C53 C58: Value: 10nF/50V
  C54 C59: Value: 100nF/16V
  C55 C60: Value: 2.2uF/10V
D19 D20 D22-D25 D27 D28 = 1N4007: Diode; Manufacturer_Name: Shikues; Datasheet Link: https://datasheet.lcsc.com/szlcsc/SK-1N4007_C126233.pdf; Height: 2.42mm; Manufacturer_Part_Number: 1N4007
D21 D26 = SMBJ33A: TVS Diode (Uni-directional); Manufacturer_Name: ON Semiconductor; Datasheet Link: http://www.onsemi.com/pub/Collateral/SMBJ9V0CA-D.pdf; Height: 2.65mm; Manufacturer_Part_Number: SMBJ33A; Mouser Part Number: 512-SMBJ33A; Mouser Price/Stock: https://www.mouser.com/Search/Refine.aspx?Keyword=512-SMBJ33A; RS Part Number: 8022320P; RS Price/Stock: http://uk.rs-online.com/web/p/products/8022320P
IC11 IC12 = MCP4921-E_SN: Integrated Circuit; Manufacturer_Name: Microchip; Manufacturer_Part_Number: MCP4921-E/SN; Allied_Number: 70046155; Datasheet Link: http://ww1.microchip.com/downloads/en/DeviceDoc/22248a.pdf; Height: 1.75mm; Mouser Part Number: 579-MCP4921-E/SN; Mouser Price/Stock: https://www.mouser.com/Search/Refine.aspx?Keyword=579-MCP4921-E%2FSN; RS Part Number: 0402803P; RS Price/Stock: http://uk.rs-online.com/web/p/products/0402803P; Allied Price/Stock: http://www.alliedelec.com/microchip-technology-inc-mcp4921-e-sn/70046155/
Q1 Q2 = BCP56,115: Transistor BJT NPN; Manufacturer_Name: Nexperia; Datasheet Link: https://assets.nexperia.com/documents/data-sheet/BCP56_BCX56_BC56PA.pdf; Height: 1.8mm; Manufacturer_Part_Number: BCP56,115; Mouser Part Number: 771-BCP56-T/R; Mouser Price/Stock: https://www.mouser.com/Search/Refine.aspx?Keyword=771-BCP56-T%2FR; RS Part Number: 1125453P; RS Price/Stock: http://uk.rs-online.com/web/p/products/1125453P
R89-R100 = Res3: Resistor; Published: 8-Jun-2000; LatestRevisionDate: 29-May-2009; LatestRevisionNote: IPC-7351 Footprint Added.; PackageReference: J1-0603; Publisher: Altium Limited; PackageDescription: Chip Resistor
  R89 R95: Value: 100R
  R90-R93 R96-R99: Value: 10K
  R94 R100: Value: 20K
U18 U20 = XTR116UA: Sensors, Sensor Conditioning, 4-20mA Transmitters 4-20mA Current Loop Transmitters; MF: Texas Instruments; SnapEDA_Link: https://www.snapeda.com/parts/XTR116UA/Texas%20Instruments/view-part/?ref=snap; MP: XTR116UA; Availability: Unavailable; Price: None; Package: SOIC-8 Texas Instruments; Value: *
U19 U21 = MAX14850ASET: as U12 on sheet BV100011_ControlAI; SnapEDA_Link: https://www.snapeda.com/parts/MAX14850ASE%2B/Maxim%20Integrated/view-part/?ref=snap; Availability: Unavailable; Price: None; Package: SOIC-16 Maxim; Value: *

## Sheet BV100011_ControlDI.SchDoc
size A
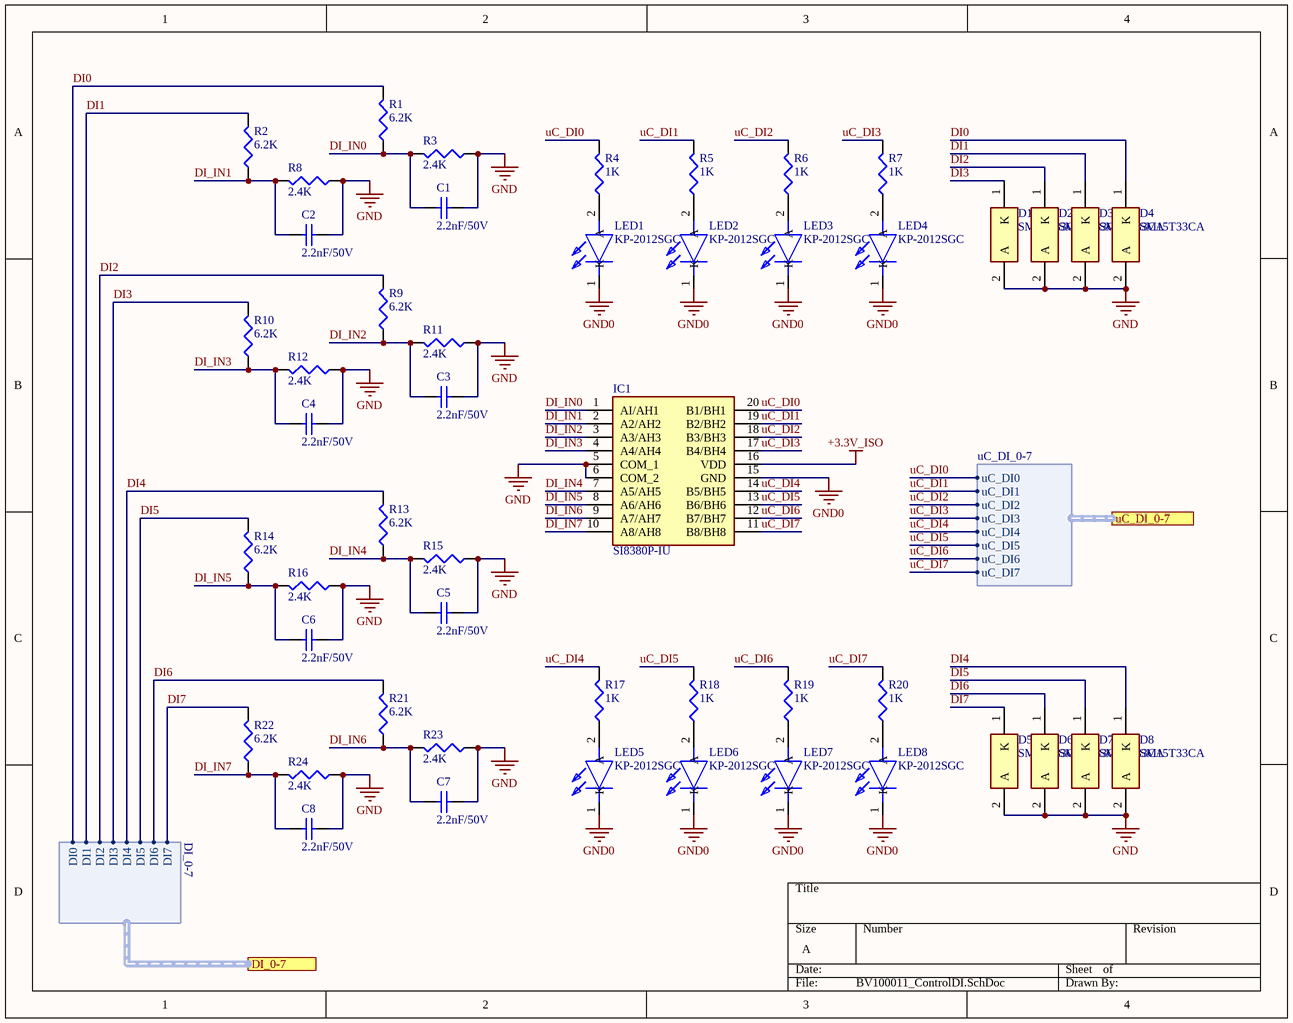
[diagram p4: BV100011_ControlDI.SchDoc]

### Parts
C1  2.2nF/50V  [C1210]
C2  2.2nF/50V  [C1210]
C3  2.2nF/50V  [C1210]
C4  2.2nF/50V  [C1210]
C5  2.2nF/50V  [C1210]
C6  2.2nF/50V  [C1210]
C7  2.2nF/50V  [C1210]
C8  2.2nF/50V  [C1210]
D1  SM15T33CA  [DIONM8059X265N]
D2  SM15T33CA  [DIONM8059X265N]
D3  SM15T33CA  [DIONM8059X265N]
D4  SM15T33CA  [DIONM8059X265N]
D5  SM15T33CA  [DIONM8059X265N]
D6  SM15T33CA  [DIONM8059X265N]
D7  SM15T33CA  [DIONM8059X265N]
D8  SM15T33CA  [DIONM8059X265N]
IC1  SI8380P-IU  [SOP64P600X175-20N]
LED1  KP-2012SGC  [LEDC2012X110N]
LED2  KP-2012SGC  [LEDC2012X110N]
LED3  KP-2012SGC  [LEDC2012X110N]
LED4  KP-2012SGC  [LEDC2012X110N]
LED5  KP-2012SGC  [LEDC2012X110N]
LED6  KP-2012SGC  [LEDC2012X110N]
LED7  KP-2012SGC  [LEDC2012X110N]
LED8  KP-2012SGC  [LEDC2012X110N]
R1  6.2K  [12Z-2010]
R2  6.2K  [12Z-2010]
R3  2.4K  [12Z-2010]
R4  1K  [0402]
R5  1K  [0402]
R6  1K  [0402]
R7  1K  [0402]
R8  2.4K  [12Z-2010]
R9  6.2K  [12Z-2010]
R10  6.2K  [12Z-2010]
R11  2.4K  [12Z-2010]
R12  2.4K  [12Z-2010]
R13  6.2K  [12Z-2010]
R14  6.2K  [12Z-2010]
R15  2.4K  [12Z-2010]
R16  2.4K  [12Z-2010]
R17  1K  [0402]
R18  1K  [0402]
R19  1K  [0402]
R20  1K  [0402]
R21  6.2K  [12Z-2010]
R22  6.2K  [12Z-2010]
R23  2.4K  [12Z-2010]
R24  2.4K  [12Z-2010]

### Ports
DI_0-7 (harness DI_0-7), uC_DI_0-7 (harness uC_DI_0-7)

### Harnesses
DI_0-7: DI0, DI1, DI2, DI3, DI4, DI5, DI6, DI7
uC_DI_0-7: uC_DI0, uC_DI1, uC_DI2, uC_DI3, uC_DI4, uC_DI5, uC_DI6, uC_DI7

### Nets
+3.3V_ISO: IC1.16(VDD)
GND: C1.2 C2.2 C3.2 C4.2 C5.2 C6.2 C7.2 C8.2 D1.2(A) D2.2(A) D3.2(A) D4.2(A) D5.2(A) D6.2(A) D7.2(A) D8.2(A) IC1.5(COM_1) IC1.6(COM_2) R3.1 R8.1 R11.1 R12.1 R15.1 R16.1 R23.1 R24.1
GND0: IC1.15(GND) LED1.1(K) LED2.1(K) LED3.1(K) LED4.1(K) LED5.1(K) LED6.1(K) LED7.1(K) LED8.1(K)
DI0: D4.1(K) R1.2 ; port DI_0-7.DI0
DI1: D3.1(K) R2.2 ; port DI_0-7.DI1
DI2: D2.1(K) R9.2 ; port DI_0-7.DI2
DI3: D1.1(K) R10.2 ; port DI_0-7.DI3
DI4: D8.1(K) R13.2 ; port DI_0-7.DI4
DI5: D7.1(K) R14.2 ; port DI_0-7.DI5
DI6: D6.1(K) R21.2 ; port DI_0-7.DI6
DI7: D5.1(K) R22.2 ; port DI_0-7.DI7
DI_IN0: C1.1 IC1.1(AI/AH1) R1.1 R3.2
DI_IN1: C2.1 IC1.2(A2/AH2) R2.1 R8.2
DI_IN2: C3.1 IC1.3(A3/AH3) R9.1 R11.2
DI_IN3: C4.1 IC1.4(A4/AH4) R10.1 R12.2
DI_IN4: C5.1 IC1.7(A5/AH5) R13.1 R15.2
DI_IN5: C6.1 IC1.8(A6/AH6) R14.1 R16.2
DI_IN6: C7.1 IC1.9(A7/AH7) R21.1 R23.2
DI_IN7: C8.1 IC1.10(A8/AH8) R22.1 R24.2
uC_DI0: IC1.20(B1/BH1) R4.2 ; port uC_DI_0-7.uC_DI0  [project net PE0]
uC_DI1: IC1.19(B2/BH2) R5.2 ; port uC_DI_0-7.uC_DI1  [project net PE1]
uC_DI2: IC1.18(B3/BH3) R6.2 ; port uC_DI_0-7.uC_DI2  [project net PE2]
uC_DI3: IC1.17(B4/BH4) R7.2 ; port uC_DI_0-7.uC_DI3  [project net PE3]
uC_DI4: IC1.14(B5/BH5) R17.2 ; port uC_DI_0-7.uC_DI4  [project net PE4]
uC_DI5: IC1.13(B6/BH6) R18.2 ; port uC_DI_0-7.uC_DI5  [project net PE5]
uC_DI6: IC1.12(B7/BH7) R19.2 ; port uC_DI_0-7.uC_DI6  [project net PE6]
uC_DI7: IC1.11(B8/BH8) R20.2 ; port uC_DI_0-7.uC_DI7  [project net PE7]
NetLED1_2: LED1.2(A) R4.1
NetLED2_2: LED2.2(A) R5.1
NetLED3_2: LED3.2(A) R6.1
NetLED4_2: LED4.2(A) R7.1
NetLED5_2: LED5.2(A) R17.1
NetLED6_2: LED6.2(A) R18.1
NetLED7_2: LED7.2(A) R19.1
NetLED8_2: LED8.2(A) R20.1

### Library data of the parts
C1-C8 = Cap Semi: Capacitor (Semiconductor SIM Model); Published: 8-Jun-2000; LatestRevisionDate: 29-May-2009; LatestRevisionNote: IPC-7351 Footprint Added.; PackageReference: C1206; Publisher: Altium Limited; PackageDescription: Chip Capacitor; Value: 2.2nF/50V
D1-D8 = SM15T33CA: Diode; Manufacturer_Name: STMicroelectronics; Allied_Number: 70390412; Datasheet Link: http://www.st.com/web/en/resource/technical/document/datasheet/CD00000724.pdf; Height: 2.65mm; Manufacturer_Part_Number: SM15T33CA; Mouser Part Number: 511-SM15T33CA; Mouser Price/Stock: https://www.mouser.com/Search/Refine.aspx?Keyword=511-SM15T33CA; RS Part Number: 9196428; RS Price/Stock: https://uk.rs-online.com/web/p/products/9196428; Allied Price/Stock: http://www.alliedelec.com/stmicroelectronics-sm15t33ca/70390412/
IC1 = SI8380P-IU: Integrated Circuit; Manufacturer_Name: Silicon Labs; Datasheet Link: https://componentsearchengine.com/Datasheets/1/SI8380P-IU.pdf; Height: 1.75mm; Mouser Part Number: 634-SI8380P-IU; Mouser Price/Stock: https://www.mouser.com/Search/Refine.aspx?Keyword=634-SI8380P-IU; Manufacturer_Part_Number: SI8380P-IU
LED1-LED8 = KP-2012SGC: LED; Manufacturer_Name: Kingbright; Datasheet Link: http://my.rs-online.com/webdocs/032f/0900766b8032fa8b.pdf; Height: 1.1mm; Manufacturer_Part_Number: KP-2012SGC; Mouser Part Number: N/A; Mouser Price/Stock: https://www.mouser.com/Search/Refine.aspx?Keyword=N%2FA; RS Part Number: 4663807; RS Price/Stock: https://uk.rs-online.com/web/p/products/4663807
R1-R24 = Res3: Resistor; Published: 8-Jun-2000; LatestRevisionDate: 29-May-2009; LatestRevisionNote: IPC-7351 Footprint Added.; PackageReference: J1-0603; Publisher: Altium Limited; PackageDescription: Chip Resistor
  R1 R2 R9 R10 R13 R21 R22: Value: 6.2K
  R3 R8 R11 R12 R15 R16 R23 R24: Value: 2.4K
  R4-R7 R17-R20: Value: 1K
  R14: Value: 6.2k

## Sheet BV100011_ControlDO.SchDoc
size A3
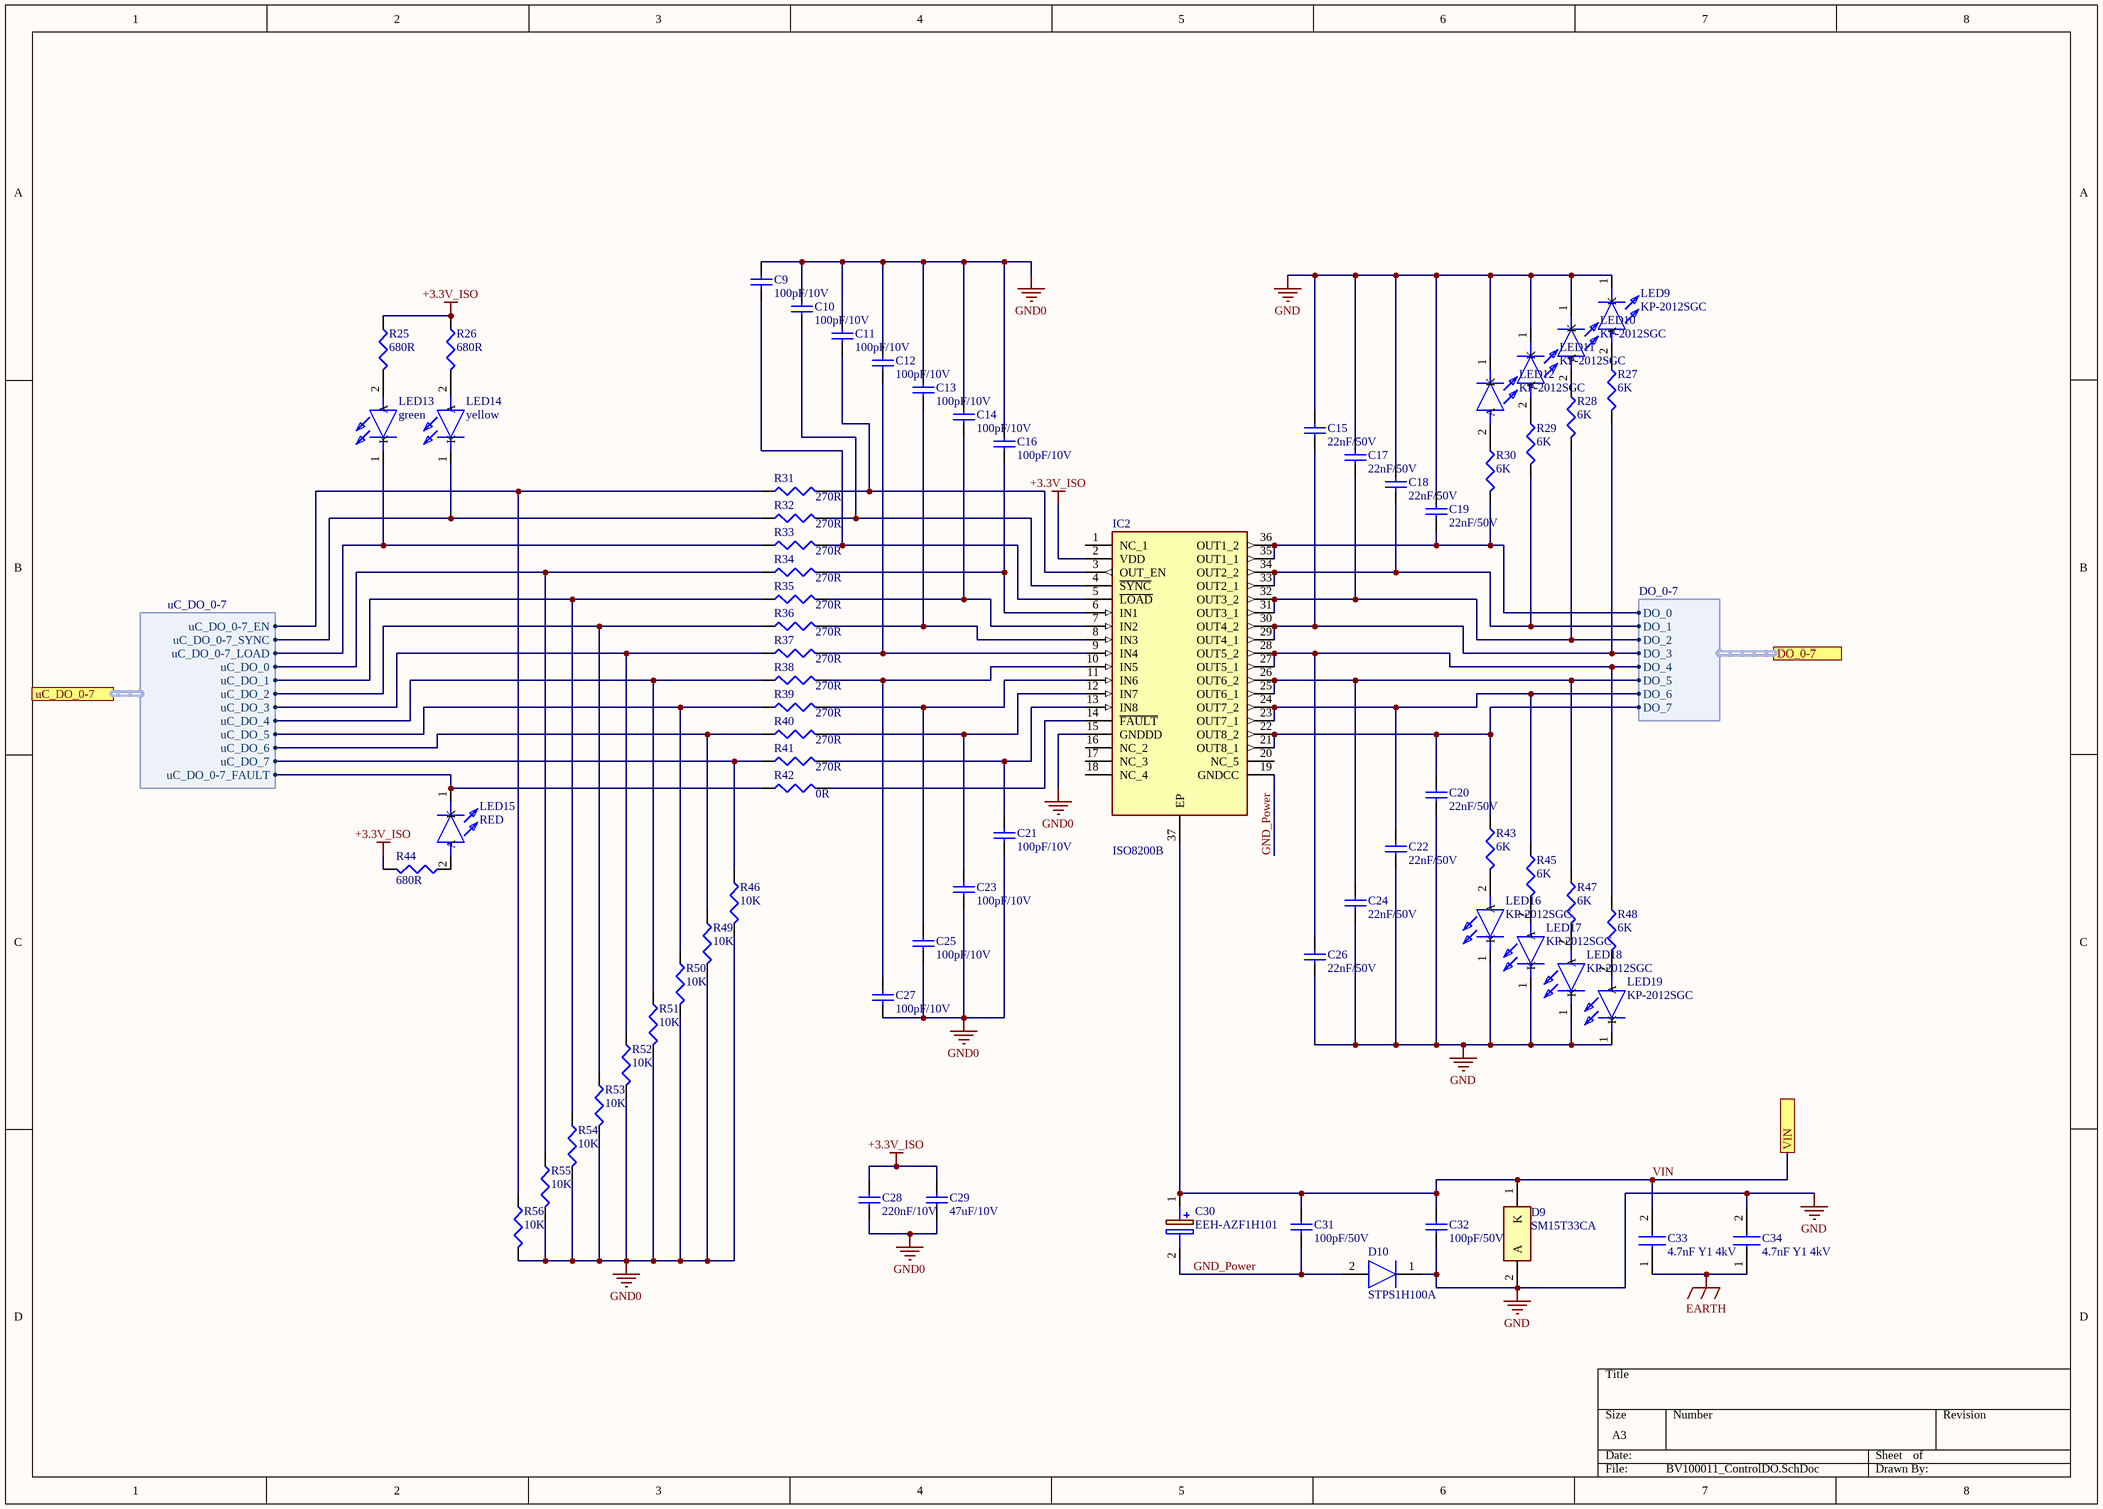
[diagram p5: BV100011_ControlDO.SchDoc]

### Parts
C9  100pF/10V  [0402]
C10  100pF/10V  [0402]
C11  100pF/10V  [0402]
C12  100pF/10V  [0402]
C13  100pF/10V  [0402]
C14  100pF/10V  [0402]
C15  22nF/50V  [C1210]
C16  100pF/10V  [0402]
C17  22nF/50V  [C1210]
C18  22nF/50V  [C1210]
C19  22nF/50V  [C1210]
C20  22nF/50V  [C1210]
C21  100pF/10V  [0402]
C22  22nF/50V  [C1210]
C23  100pF/10V  [0402]
C24  22nF/50V  [C1210]
C25  100pF/10V  [0402]
C26  22nF/50V  [C1210]
C27  100pF/10V  [0402]
C28  220nF/10V  [C1210]
C29  47uF/10V  [C1210]
C30  EEH-AZF1H101  [CAPPRD500W65D1000H1050]
C31  100pF/50V  [C1210]
C32  100pF/50V  [C1210]
C33  4.7nF Y1 4kV  [VY1472M63Y5UQ63V0]
C34  4.7nF Y1 4kV  [VY1472M63Y5UQ63V0]
D9  SM15T33CA  [DIONM8059X265N]
D10  STPS1H100A  [DIOM5126X265N]
IC2  ISO8200B  [SOP65P1420X360-37N]
LED9  KP-2012SGC  [LEDC2012X110N]
LED10  KP-2012SGC  [LEDC2012X110N]
LED11  KP-2012SGC  [LEDC2012X110N]
LED12  KP-2012SGC  [LEDC2012X110N]
LED13  green  [LEDC2012X110N]
LED14  yellow  [LEDC2012X110N]
LED15  RED  [LEDC2012X110N]
LED16  KP-2012SGC  [LEDC2012X110N]
LED17  KP-2012SGC  [LEDC2012X110N]
LED18  KP-2012SGC  [LEDC2012X110N]
LED19  KP-2012SGC  [LEDC2012X110N]
R25  680R  [0402]
R26  680R  [0402]
R27  6K  [0805R]
R28  6K  [0805R]
R29  6K  [0805R]
R30  6K  [0805R]
R31  270R  [0402]
R32  270R  [0402]
R33  270R  [0402]
R34  270R  [0402]
R35  270R  [0402]
R36  270R  [0402]
R37  270R  [0402]
R38  270R  [0402]
R39  270R  [0402]
R40  270R  [0402]
R41  270R  [0402]
R42  0R  [0402]
R43  6K  [0805R]
R44  680R  [0402]
R45  6K  [0805R]
R46  10K  [0402]
R47  6K  [0805R]
R48  6K  [0805R]
R49  10K  [0402]
R50  10K  [0402]
R51  10K  [0402]
R52  10K  [0402]
R53  10K  [0402]
R54  10K  [0402]
R55  10K  [0402]
R56  10K  [0402]

### Ports
DO_0-7 (harness DO_0-7), uC_DO_0-7 (harness uC_DO_0-7), VIN

### Harnesses
DO_0-7: DO_0, DO_1, DO_2, DO_3, DO_4, DO_5, DO_6, DO_7
uC_DO_0-7: uC_DO_0-7_EN, uC_DO_0-7_SYNC, uC_DO_0-7_LOAD, uC_DO_0, uC_DO_1, uC_DO_2, uC_DO_3, uC_DO_4, uC_DO_5, uC_DO_6, uC_DO_7, uC_DO_0-7_FAULT

### Nets
+3.3V_ISO: C28.2 C29.2 IC2.2(VDD) R25.1 R26.1 R44.2
EARTH: C33.1 C34.1
GND: C15.1 C17.1 C18.1 C19.1 C20.2 C22.2 C24.2 C26.2 C32.1 C34.2 D9.2(A) D10.1(K) LED9.1(K) LED10.1(K) LED11.1(K) LED12.1(K) LED16.1(K) LED17.1(K) LED18.1(K) LED19.1(K)
GND0: C9.1 C10.1 C11.1 C12.1 C13.1 C14.1 C16.1 C21.2 C23.2 C25.2 C27.2 C28.1 C29.1 IC2.15(GNDDD) R46.2 R49.2 R50.2 R51.2 R52.2 R53.2 R54.2 R55.2 R56.2
GND_Power: C30.2(-) C31.1 D10.2(A) IC2.19(GNDCC)
PF0: R34.1 R55.1 ; port uC_DO_0-7.uC_DO_0
PF1: R35.1 R54.1 ; port uC_DO_0-7.uC_DO_1
PF2: R36.1 R53.1 ; port uC_DO_0-7.uC_DO_2
PF3: R37.1 R52.1 ; port uC_DO_0-7.uC_DO_3
PF4: R38.1 R51.1 ; port uC_DO_0-7.uC_DO_4
PF5: R39.1 R50.1 ; port uC_DO_0-7.uC_DO_5
PF6: R40.1 R49.1 ; port uC_DO_0-7.uC_DO_6
PF7: R41.1 R46.1 ; port uC_DO_0-7.uC_DO_7
PF8: R31.1 R56.1 ; port uC_DO_0-7.uC_DO_0-7_EN
PF9: LED15.1(K) R42.1 ; port uC_DO_0-7.uC_DO_0-7_FAULT
PF10: LED14.1(K) R32.1 ; port uC_DO_0-7.uC_DO_0-7_SYNC
PF11: LED13.1(K) R33.1 ; port uC_DO_0-7.uC_DO_0-7_LOAD
VIN: C30.1(+) C31.2 C32.2 C33.2 D9.1(K) IC2.37(EP) ; port VIN
NetC9_2: C9.2 IC2.5(~{LOAD}) R33.2
NetC10_2: C10.2 IC2.4(~{SYNC}) R32.2
NetC11_2: C11.2 IC2.3(OUT_EN) R31.2
NetC12_2: C12.2 IC2.9(IN4) R37.2
NetC13_2: C13.2 IC2.8(IN3) R36.2
NetC14_2: C14.2 IC2.7(IN2) R35.2
NetC15_2: C15.2 IC2.29(OUT4_1) IC2.30(OUT4_2) R27.2 ; port DO_0-7.DO_3
NetC16_2: C16.2 IC2.6(IN1) R34.2
NetC17_2: C17.2 IC2.31(OUT3_1) IC2.32(OUT3_2) R28.2 ; port DO_0-7.DO_2
NetC18_2: C18.2 IC2.33(OUT2_1) IC2.34(OUT2_2) R29.2 ; port DO_0-7.DO_1
NetC19_2: C19.2 IC2.35(OUT1_1) IC2.36(OUT1_2) R30.2 ; port DO_0-7.DO_0
NetC20_1: C20.1 IC2.21(OUT8_1) IC2.22(OUT8_2) R43.1 ; port DO_0-7.DO_7
NetC21_1: C21.1 IC2.13(IN8) R41.2
NetC22_1: C22.1 IC2.23(OUT7_1) IC2.24(OUT7_2) R45.1 ; port DO_0-7.DO_6
NetC23_1: C23.1 IC2.12(IN7) R40.2
NetC24_1: C24.1 IC2.25(OUT6_1) IC2.26(OUT6_2) R47.1 ; port DO_0-7.DO_5
NetC25_1: C25.1 IC2.11(IN6) R39.2
NetC26_1: C26.1 IC2.27(OUT5_1) IC2.28(OUT5_2) R48.1 ; port DO_0-7.DO_4
NetC27_1: C27.1 IC2.10(IN5) R38.2
NetIC2_14: IC2.14(~{FAULT}) R42.2
NetLED9_2: LED9.2(A) R27.1
NetLED10_2: LED10.2(A) R28.1
NetLED11_2: LED11.2(A) R29.1
NetLED12_2: LED12.2(A) R30.1
NetLED13_2: LED13.2(A) R25.2
NetLED14_2: LED14.2(A) R26.2
NetLED15_2: LED15.2(A) R44.1
NetLED16_2: LED16.2(A) R43.2
NetLED17_2: LED17.2(A) R45.2
NetLED18_2: LED18.2(A) R47.2
NetLED19_2: LED19.2(A) R48.2

Not connected (* = marked no-connect by the designer): IC2 1(NC_1) 16(NC_2) 17(NC_3) 18(NC_4) 20(NC_5)

### Library data of the parts
C9-C29 C31 C32 = Cap Semi: Capacitor (Semiconductor SIM Model); Published: 8-Jun-2000; LatestRevisionDate: 29-May-2009; LatestRevisionNote: IPC-7351 Footprint Added.; PackageReference: C1206; Publisher: Altium Limited; PackageDescription: Chip Capacitor
  C9-C14 C16 C21 C23 C25 C27: Value: 100pF/10V
  C15 C17-C20 C22 C24 C26: Value: 22nF/50V
  C28: Value: 220nF/10V
  C29: Value: 47uF/10V
  C31 C32: Value: 100pF/50V
C30 = EEH-AZF1H101: Capacitor Polarised; Manufacturer_Name: Panasonic; Datasheet Link: https://componentsearchengine.com/Datasheets/1/EEH-AZF1H101.pdf; Height: 10.5mm; Manufacturer_Part_Number: EEH-AZF1H101; Mouser Part Number: 667-EEH-AZF1H101; Mouser Price/Stock: https://www.mouser.com/Search/Refine.aspx?Keyword=667-EEH-AZF1H101
C33 C34 = VY1472M63Y5UQ63V0: Capacitor; Manufacturer_Name: VISHAY BC COMPONENTS; Allied_Number: 70122998; Datasheet Link: http://www.vishay.com/docs/28537/vy1series.pdf; Height: 19mm; Manufacturer_Part_Number: VY1472M63Y5UQ63V0; Allied Price/Stock: https://www.alliedelec.com/bccomponents-vishay-vy1472m63y5uq63v0/70122998/
D9 = SM15T33CA: as D1 on sheet BV100011_ControlDI; Datasheet Link: http://www.st.com/web/en/resource/technical/document/datasheet/CD00000724.pdf; Height: 2.65mm; Manufacturer_Part_Number: SM15T33CA; Mouser Part Number: 511-SM15T33CA; Mouser Price/Stock: https://www.mouser.com/Search/Refine.aspx?Keyword=511-SM15T33CA; RS Part Number: 9196428; RS Price/Stock: https://uk.rs-online.com/web/p/products/9196428; Allied Price/Stock: http://www.alliedelec.com/stmicroelectronics-sm15t33ca/70390412/
D10 = STPS1H100A: Diode; Manufacturer_Name: STMicroelectronics; Allied_Number: 70014065; Datasheet Link: http://www.st.com/web/en/resource/technical/document/datasheet/CD00001304.pdf; Height: 2.65mm; Manufacturer_Part_Number: STPS1H100A; Mouser Part Number: 511-STPS1H100A; Mouser Price/Stock: https://www.mouser.com/Search/Refine.aspx?Keyword=511-STPS1H100A; RS Part Number: 0249892P; RS Price/Stock: http://uk.rs-online.com/web/p/products/0249892P; Allied Price/Stock: http://www.alliedelec.com/stmicroelectronics-stps1h100a/70014065/
IC2 = ISO8200B: Integrated Circuit; Manufacturer_Name: STMicroelectronics; Datasheet Link: https://componentsearchengine.com/Datasheets/1/ISO8200B.pdf; Height: 3.6mm; Mouser Part Number: 511-ISO8200B; Mouser Price/Stock: https://www.mouser.com/Search/Refine.aspx?Keyword=511-ISO8200B; Manufacturer_Part_Number: ISO8200B
LED9-LED19 = KP-2012SGC: LED; Manufacturer_Name: Kingbright; Datasheet Link: http://my.rs-online.com/webdocs/032f/0900766b8032fa8b.pdf; Height: 1.1mm; Manufacturer_Part_Number: KP-2012SGC; Mouser Part Number: N/A; Mouser Price/Stock: https://www.mouser.com/Search/Refine.aspx?Keyword=N%2FA; RS Part Number: 4663807; RS Price/Stock: https://uk.rs-online.com/web/p/products/4663807
R25-R56 = Res3: Resistor; Published: 8-Jun-2000; LatestRevisionDate: 29-May-2009; LatestRevisionNote: IPC-7351 Footprint Added.; PackageReference: J1-0603; Publisher: Altium Limited; PackageDescription: Chip Resistor
  R25 R26 R44: Value: 680R
  R27-R30 R43 R45 R47 R48: Value: 6K
  R31-R41: Value: 270R
  R42: Value: 0R
  R46 R49-R56: Value: 10K

## Sheet BV100011_ControlRS485.SchDoc
size B
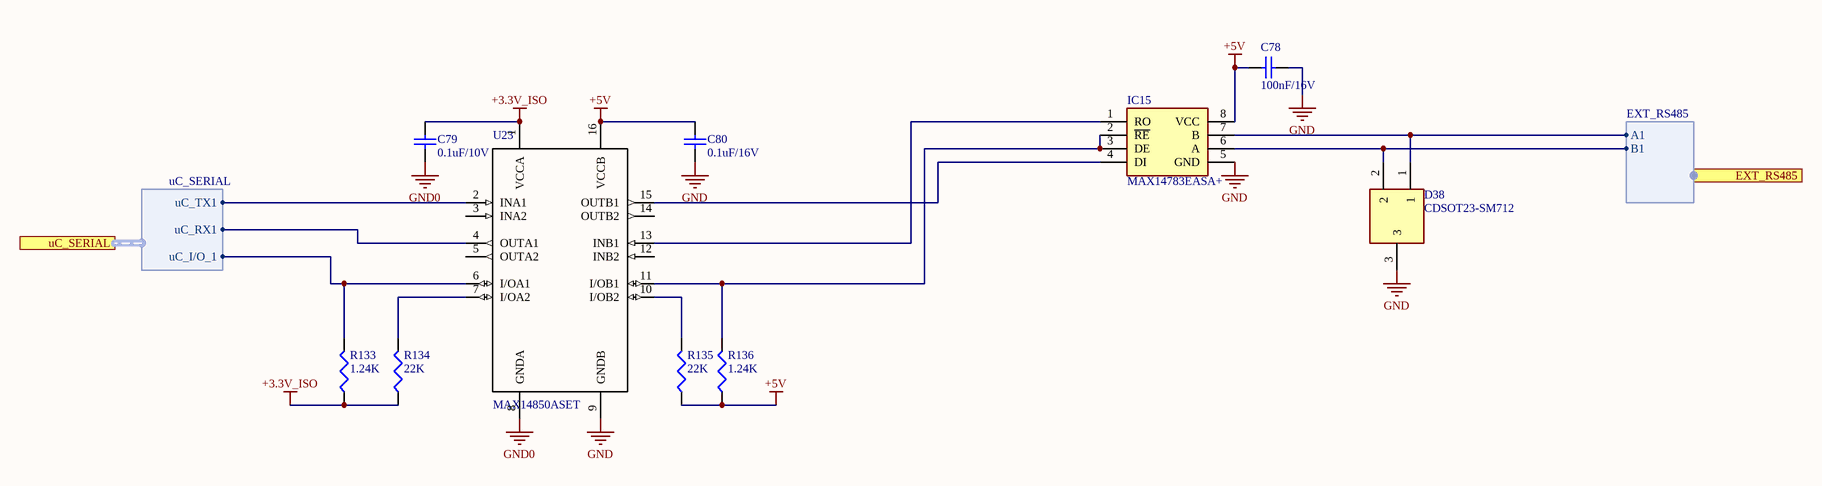
[diagram p6: BV100011_ControlRS485.SchDoc]

### Parts
C78  100nF/16V  [C1206]
C79  0.1uF/10V  [C1206]
C80  0.1uF/16V  [C1206]
D38  CDSOT23-SM712  [SOT95P230X117-3N]
IC15  MAX14783EASA+  [SOIC127P600X175-8N]
R133  1.24K  [J1-0603]
R134  22K  [J1-0603]
R135  22K  [C1206]
R136  1.24K  [C1206]
U23  MAX14850ASET  [*SOIC127P600X175-16N]

### Ports
EXT_RS485 (harness EXT_RS485), uC_SERIAL (harness uC_SERIAL)

### Harnesses
uC_SERIAL: uC_TX1, uC_RX1, uC_I/O_1
EXT_RS485: A1, B1

### Nets
+3.3V_ISO: C79.1 R133.1 R134.1 U23.1(VCCA)
+5V: C78.1 C80.1 IC15.8(VCC) R135.1 R136.1 U23.16(VCCB)
GND: C78.2 C80.2 D38.3 IC15.5(GND) U23.9(GNDB)
GND0: C79.2 U23.8(GNDA)
PD4: R133.2 U23.6(I/OA1) ; port uC_SERIAL.uC_I/O_1
PD5: U23.2(INA1) ; port uC_SERIAL.uC_TX1
PD6: U23.4(OUTA1) ; port uC_SERIAL.uC_RX1
NetD38_1: D38.1 IC15.7(B) ; port EXT_RS485.A1
NetD38_2: D38.2 IC15.6(A) ; port EXT_RS485.B1
NetIC15_1: IC15.1(RO) U23.13(INB1)
NetIC15_2: IC15.2(~{RE}) IC15.3(DE) R136.2 U23.11(I/OB1)
NetIC15_4: IC15.4(DI) U23.15(OUTB1)
NetR134_2: R134.2 U23.7(I/OA2)
NetR135_2: R135.2 U23.10(I/OB2)

Not connected (* = marked no-connect by the designer): U23 3(INA2) 5(OUTA2) 12(INB2) 14(OUTB2)

### Library data of the parts
C78-C80 = Cap Semi: Capacitor (Semiconductor SIM Model); Published: 8-Jun-2000; LatestRevisionDate: 29-May-2009; LatestRevisionNote: IPC-7351 Footprint Added.; PackageReference: C1206; Publisher: Altium Limited; PackageDescription: Chip Capacitor
  C78: Value: 100nF/16V
  C79: Value: 0.1uF/10V
  C80: Value: 0.1uF/16V
D38 = CDSOT23-SM712: Diode; Manufacturer_Name: Bourns; Allied_Number: 70154680; Datasheet Link: http://uk.rs-online.com/web/p/products/7673728; Height: 1.17mm; Manufacturer_Part_Number: CDSOT23-SM712; Mouser Part Number: 652-CDSOT23-SM712; Mouser Price/Stock: https://www.mouser.com/Search/Refine.aspx?Keyword=652-CDSOT23-SM712; RS Part Number: 7673728P; RS Price/Stock: http://uk.rs-online.com/web/p/products/7673728P; Allied Price/Stock: https://www.alliedelec.com/bourns-cdsot23-sm712/70154680/
IC15 = MAX14783EASA+: Integrated Circuit; Manufacturer_Name: Maxim Integrated; Datasheet Link: https://datasheets.maximintegrated.com/en/ds/MAX14783E.pdf; Height: 1.75mm; Manufacturer_Part_Number: MAX14783EASA+; Mouser Part Number: 700-MAX14783EASA+; Mouser Price/Stock: https://www.mouser.com/Search/Refine.aspx?Keyword=700-MAX14783EASA%2B
R133-R136 = Res3: Resistor; Published: 8-Jun-2000; LatestRevisionDate: 29-May-2009; LatestRevisionNote: IPC-7351 Footprint Added.; PackageReference: J1-0603; Publisher: Altium Limited; PackageDescription: Chip Resistor
  R133 R136: Value: 1.24K
  R134 R135: Value: 22K
U23 = MAX14850ASET: as U12 on sheet BV100011_ControlAI; SnapEDA_Link: https://www.snapeda.com/parts/MAX14850ASE%2B/Maxim%20Integrated/view-part/?ref=snap; Availability: Unavailable; Price: None; Package: SOIC-16 Maxim; Value: *

## Sheet BV100011_ControlPower.SchDoc
size Tabloid
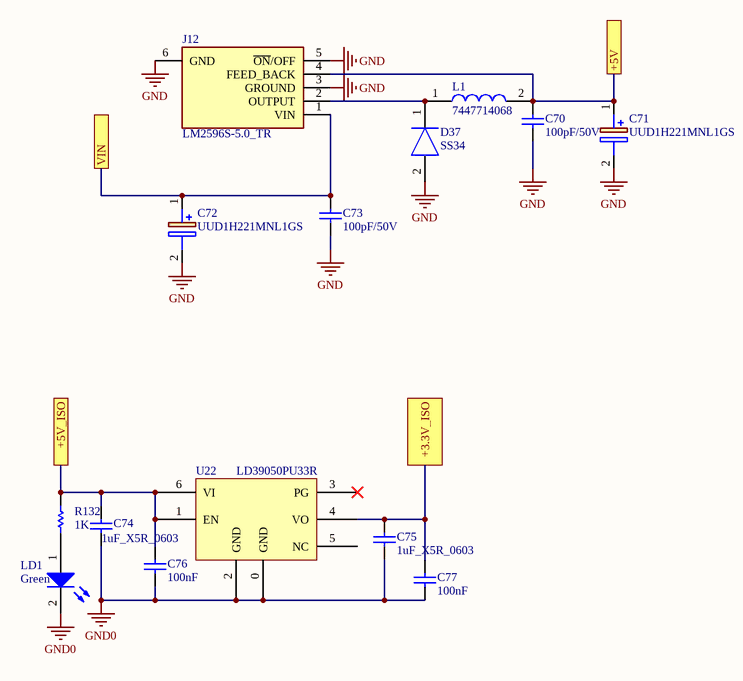
[diagram p7: BV100011_ControlPower.SchDoc]

### Parts
C70  100pF/50V  [C1210]
C71  UUD1H221MNL1GS  [CAPAE1030X1050N]
C72  UUD1H221MNL1GS  [CAPAE1030X1050N]
C73  100pF/50V  [C1210]
C74  1uF_X5R_0603  [0603C]
C75  1uF_X5R_0603  [0603C]
C76  100nF  [0603C]
C77  100nF  [0603C]
D37  SS34  [DIOM6959X262N]
J12  LM2596S-5.0_TR  [LM2596S50TR]
L1  7447714068  [WE-PD_1030/105054]
LD1  Green  [0603D-G]
R132  1K  [0603R]
U22  LD39050PU33R  [DFN6_0R95_3x3_TP]

### Ports
+3.3V_ISO, +5V, +5V_ISO, VIN

### Nets
+3.3V_ISO: C75.1 C77.2 U22.4(VO) ; port +3.3V_ISO
+5V: C70.2 C71.1(+) J12.4(FEED_BACK) L1.2 ; port +5V
+5V_ISO: C74.1 C76.2 R132.2 U22.1(EN) U22.6(VI) ; port +5V_ISO
GND: C70.1 C71.2(-) C72.2(-) C73.1 D37.2(A) J12.3(GROUND) J12.5(~{ON}/OFF) J12.6(GND)
GND0: C74.2 C75.2 C76.1 C77.1 LD1.2(K) U22.0(GND) U22.2(GND)
VIN: C72.1(+) C73.2 J12.1(VIN) ; port VIN
NetD37_1: D37.1(K) J12.2(OUTPUT) L1.1
NetLD1_1: LD1.1(A) R132.1

Not connected (* = marked no-connect by the designer): U22 3(PG)* 5(NC)

### Library data of the parts
C70 C73 = Cap Semi: Capacitor (Semiconductor SIM Model); Published: 8-Jun-2000; LatestRevisionDate: 29-May-2009; LatestRevisionNote: IPC-7351 Footprint Added.; PackageReference: C1206; Publisher: Altium Limited; PackageDescription: Chip Capacitor; Value: 100pF/50V
C71 C72 = UUD1H221MNL1GS: Capacitor Polarised; Manufacturer_Name: Nichicon; Datasheet Link: https://componentsearchengine.com/Datasheets/2/UUD1H221MNL1GS.pdf; Height: 10.5mm; Manufacturer_Part_Number: UUD1H221MNL1GS; Arrow Part Number: UUD1H221MNL1GS; Arrow Price/Stock: https://www.arrow.com/en/products/uud1h221mnl1gs/nichicon; Mouser Part Number: 647-UUD1H221MNL; Mouser Price/Stock: https://www.mouser.co.uk/ProductDetail/Nichicon/UUD1H221MNL1GS?qs=vtpzqDgAobnaECklx3mHVg%3D%3D
C74 C75 = CAP SMD 0603  X5R 1µF 25V 10%: 0603  X5R 1µF; Rated voltage: 25V; Tolerance: 10%; Manufacturer: *; Manufacturer P/N: *; Order code Farnell: 1288202RL; Value: 1µF; Power: *; Technology: X5R; Temperature  Factor: *; Temperature Max: +125°C; Temperature Min: -55°C; STS Code: *
C76 C77 = Capacitor_ST: Capacitor 0402 / 0603 / 0805; Revision: July-2002: Re-released for DXP Platform.; Value: 100nF
D37 = SS34: Diode; Manufacturer_Name: HY Electronic Corp; Datasheet Link: http://www.hygroup.com.tw/upfiles/ADUpload/all_/SS32%20thru%20SS310(242-243).pdf; Height: 2.62mm; Manufacturer_Part_Number: SS34
J12 = LM2596S-5.0_TR: Connector; Manufacturer_Name: National Electronics; Manufacturer_Part_Number: LM2596S-5.0/TR; Datasheet Link: https://www.jameco.com/Jameco/Products/ProdDS/895246.pdf; Height: 4.65mm
L1 = 7447714068: Inductor; Manufacturer_Name: Wurth Elektronik; Manufacturer_Part_Number: 7447714068; Mouser Part Number: 710-7447714068; Mouser Price/Stock: https://www.mouser.com/Search/Refine.aspx?Keyword=710-7447714068
LD1 = LED2: Typical RED, GREEN, YELLOW, AMBER GaAs LED; Published: 8-Jun-2000; Revision: July-2002: Re-released for DXP Platform.; Publisher: Altium Limited
R132 = Resistor_ST: Resistor 0402 / 0603 / 0805; Value: 10K
U22 = LD39050P

## Sheet BV100011_ControlDI_8-15.SchDoc
size A
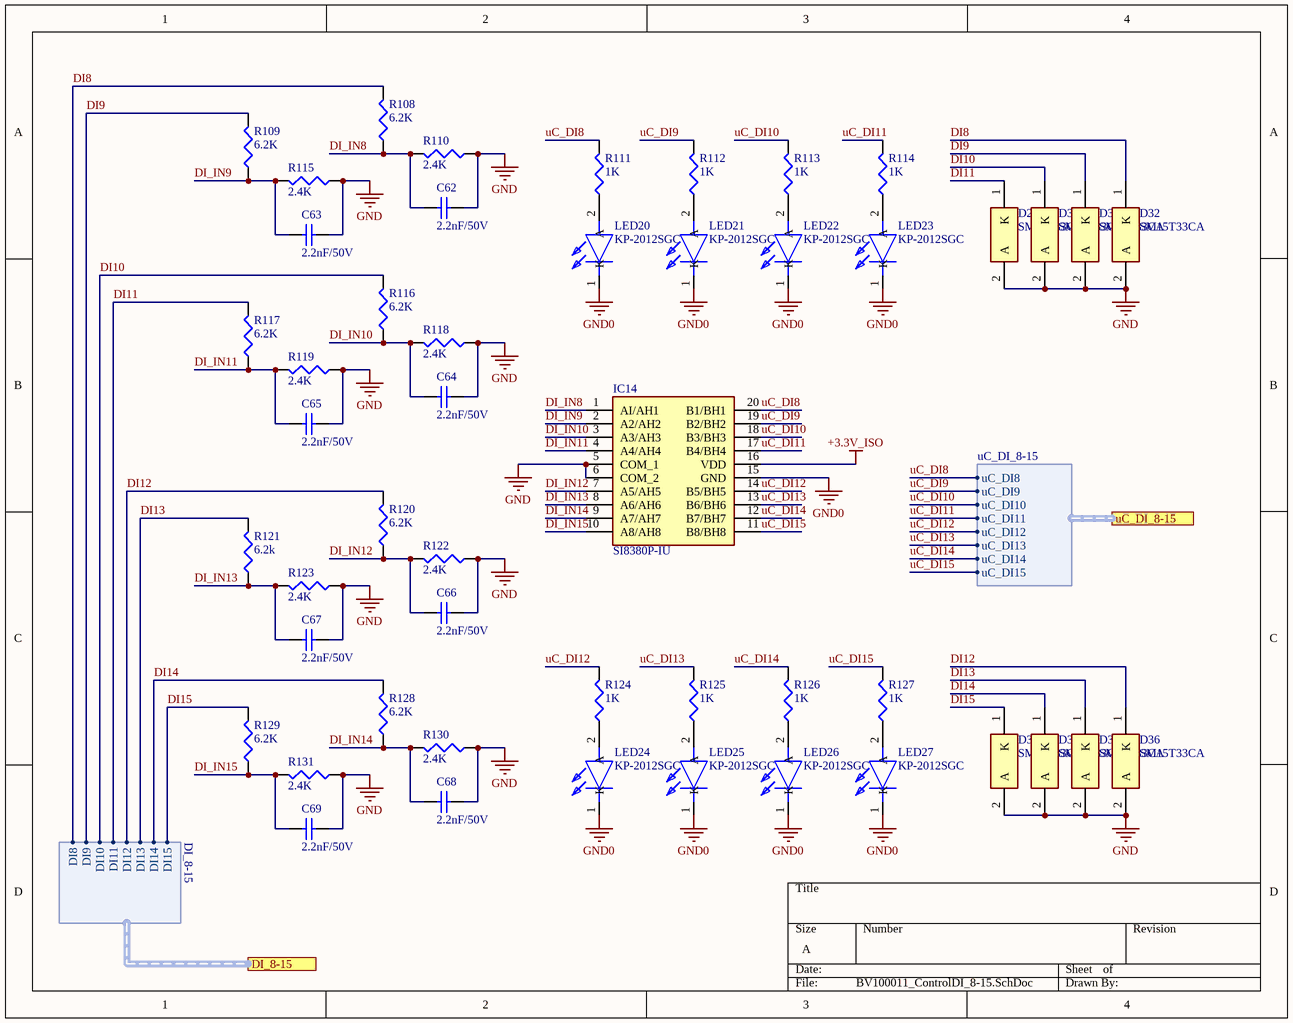
[diagram p8: BV100011_ControlDI_8-15.SchDoc]

### Parts
C62  2.2nF/50V  [C1210]
C63  2.2nF/50V  [C1210]
C64  2.2nF/50V  [C1210]
C65  2.2nF/50V  [C1210]
C66  2.2nF/50V  [C1210]
C67  2.2nF/50V  [C1210]
C68  2.2nF/50V  [C1210]
C69  2.2nF/50V  [C1210]
D29  SM15T33CA  [DIONM8059X265N]
D30  SM15T33CA  [DIONM8059X265N]
D31  SM15T33CA  [DIONM8059X265N]
D32  SM15T33CA  [DIONM8059X265N]
D33  SM15T33CA  [DIONM8059X265N]
D34  SM15T33CA  [DIONM8059X265N]
D35  SM15T33CA  [DIONM8059X265N]
D36  SM15T33CA  [DIONM8059X265N]
IC14  SI8380P-IU  [SOP64P600X175-20N]
LED20  KP-2012SGC  [LEDC2012X110N]
LED21  KP-2012SGC  [LEDC2012X110N]
LED22  KP-2012SGC  [LEDC2012X110N]
LED23  KP-2012SGC  [LEDC2012X110N]
LED24  KP-2012SGC  [LEDC2012X110N]
LED25  KP-2012SGC  [LEDC2012X110N]
LED26  KP-2012SGC  [LEDC2012X110N]
LED27  KP-2012SGC  [LEDC2012X110N]
R108  6.2K  [12Z-2010]
R109  6.2K  [12Z-2010]
R110  2.4K  [12Z-2010]
R111  1K  [0402]
R112  1K  [0402]
R113  1K  [0402]
R114  1K  [0402]
R115  2.4K  [12Z-2010]
R116  6.2K  [12Z-2010]
R117  6.2K  [12Z-2010]
R118  2.4K  [12Z-2010]
R119  2.4K  [12Z-2010]
R120  6.2K  [12Z-2010]
R121  6.2k  [12Z-2010]
R122  2.4K  [12Z-2010]
R123  2.4K  [12Z-2010]
R124  1K  [0402]
R125  1K  [0402]
R126  1K  [0402]
R127  1K  [0402]
R128  6.2K  [12Z-2010]
R129  6.2K  [12Z-2010]
R130  2.4K  [12Z-2010]
R131  2.4K  [12Z-2010]

### Ports
DI_8-15 (harness DI_8-15), uC_DI_8-15 (harness uC_DI_8-15)

### Harnesses
DI_8-15: DI8, DI9, DI10, DI11, DI12, DI13, DI14, DI15
uC_DI_8-15: uC_DI8, uC_DI9, uC_DI10, uC_DI11, uC_DI12, uC_DI13, uC_DI14, uC_DI15

### Nets
+3.3V_ISO: IC14.16(VDD)
GND: C62.2 C63.2 C64.2 C65.2 C66.2 C67.2 C68.2 C69.2 D29.2(A) D30.2(A) D31.2(A) D32.2(A) D33.2(A) D34.2(A) D35.2(A) D36.2(A) IC14.5(COM_1) IC14.6(COM_2) R110.1 R115.1 R118.1 R119.1 R122.1 R123.1 R130.1 R131.1
GND0: IC14.15(GND) LED20.1(K) LED21.1(K) LED22.1(K) LED23.1(K) LED24.1(K) LED25.1(K) LED26.1(K) LED27.1(K)
DI8: D32.1(K) R108.2 ; port DI_8-15.DI8
DI9: D31.1(K) R109.2 ; port DI_8-15.DI9
DI10: D30.1(K) R116.2 ; port DI_8-15.DI10
DI11: D29.1(K) R117.2 ; port DI_8-15.DI11
DI12: D36.1(K) R120.2 ; port DI_8-15.DI12
DI13: D35.1(K) R121.2 ; port DI_8-15.DI13
DI14: D34.1(K) R128.2 ; port DI_8-15.DI14
DI15: D33.1(K) R129.2 ; port DI_8-15.DI15
DI_IN8: C62.1 IC14.1(AI/AH1) R108.1 R110.2
DI_IN9: C63.1 IC14.2(A2/AH2) R109.1 R115.2
DI_IN10: C64.1 IC14.3(A3/AH3) R116.1 R118.2
DI_IN11: C65.1 IC14.4(A4/AH4) R117.1 R119.2
DI_IN12: C66.1 IC14.7(A5/AH5) R120.1 R122.2
DI_IN13: C67.1 IC14.8(A6/AH6) R121.1 R123.2
DI_IN14: C68.1 IC14.9(A7/AH7) R128.1 R130.2
DI_IN15: C69.1 IC14.10(A8/AH8) R129.1 R131.2
uC_DI8: IC14.20(B1/BH1) R111.2 ; port uC_DI_8-15.uC_DI8  [project net PE8]
uC_DI9: IC14.19(B2/BH2) R112.2 ; port uC_DI_8-15.uC_DI9  [project net PE9]
uC_DI10: IC14.18(B3/BH3) R113.2 ; port uC_DI_8-15.uC_DI10  [project net PE10]
uC_DI11: IC14.17(B4/BH4) R114.2 ; port uC_DI_8-15.uC_DI11  [project net PE11]
uC_DI12: IC14.14(B5/BH5) R124.2 ; port uC_DI_8-15.uC_DI12  [project net PE12]
uC_DI13: IC14.13(B6/BH6) R125.2 ; port uC_DI_8-15.uC_DI13  [project net PE13]
uC_DI14: IC14.12(B7/BH7) R126.2 ; port uC_DI_8-15.uC_DI14  [project net PE14]
uC_DI15: IC14.11(B8/BH8) R127.2 ; port uC_DI_8-15.uC_DI15  [project net PE15]
NetLED20_2: LED20.2(A) R111.1
NetLED21_2: LED21.2(A) R112.1
NetLED22_2: LED22.2(A) R113.1
NetLED23_2: LED23.2(A) R114.1
NetLED24_2: LED24.2(A) R124.1
NetLED25_2: LED25.2(A) R125.1
NetLED26_2: LED26.2(A) R126.1
NetLED27_2: LED27.2(A) R127.1

### Library data of the parts
C62-C69 = Cap Semi: Capacitor (Semiconductor SIM Model); Published: 8-Jun-2000; LatestRevisionDate: 29-May-2009; LatestRevisionNote: IPC-7351 Footprint Added.; PackageReference: C1206; Publisher: Altium Limited; PackageDescription: Chip Capacitor; Value: 2.2nF/50V
D29-D36 = SM15T33CA: as D1 on sheet BV100011_ControlDI; Datasheet Link: http://www.st.com/web/en/resource/technical/document/datasheet/CD00000724.pdf; Height: 2.65mm; Manufacturer_Part_Number: SM15T33CA; Mouser Part Number: 511-SM15T33CA; Mouser Price/Stock: https://www.mouser.com/Search/Refine.aspx?Keyword=511-SM15T33CA; RS Part Number: 9196428; RS Price/Stock: https://uk.rs-online.com/web/p/products/9196428; Allied Price/Stock: http://www.alliedelec.com/stmicroelectronics-sm15t33ca/70390412/
IC14 = SI8380P-IU: as IC1 on sheet BV100011_ControlDI; Datasheet Link: https://componentsearchengine.com/Datasheets/1/SI8380P-IU.pdf; Height: 1.75mm; Mouser Part Number: 634-SI8380P-IU; Mouser Price/Stock: https://www.mouser.com/Search/Refine.aspx?Keyword=634-SI8380P-IU; Manufacturer_Part_Number: SI8380P-IU
LED20-LED27 = KP-2012SGC: LED; Manufacturer_Name: Kingbright; Datasheet Link: http://my.rs-online.com/webdocs/032f/0900766b8032fa8b.pdf; Height: 1.1mm; Manufacturer_Part_Number: KP-2012SGC; Mouser Part Number: N/A; Mouser Price/Stock: https://www.mouser.com/Search/Refine.aspx?Keyword=N%2FA; RS Part Number: 4663807; RS Price/Stock: https://uk.rs-online.com/web/p/products/4663807
R108-R131 = Res3: Resistor; Published: 8-Jun-2000; LatestRevisionDate: 29-May-2009; LatestRevisionNote: IPC-7351 Footprint Added.; PackageReference: J1-0603; Publisher: Altium Limited; PackageDescription: Chip Resistor
  R108 R109 R116 R117 R120 R128 R129: Value: 6.2K
  R110 R115 R118 R119 R122 R123 R130 R131: Value: 2.4K
  R111-R114 R124-R127: Value: 1K
  R121: Value: 6.2k